# EAGLE schematic retrostoneA20-1.15 (EAGLE 7.6.0), part 1 of 2

## Sheet 1 of 2
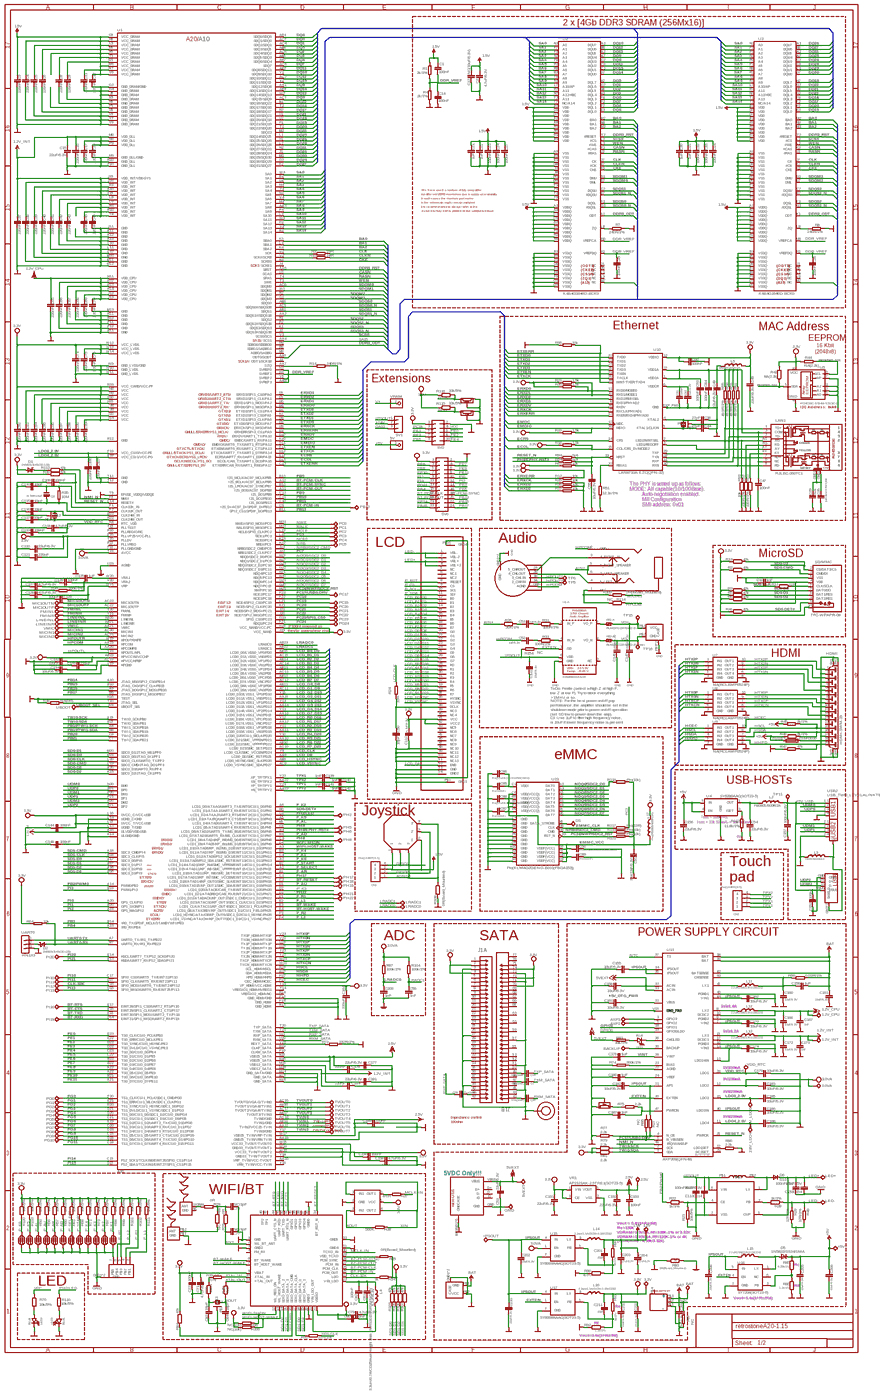
[diagram p0: schematic, sheet 1, overview]
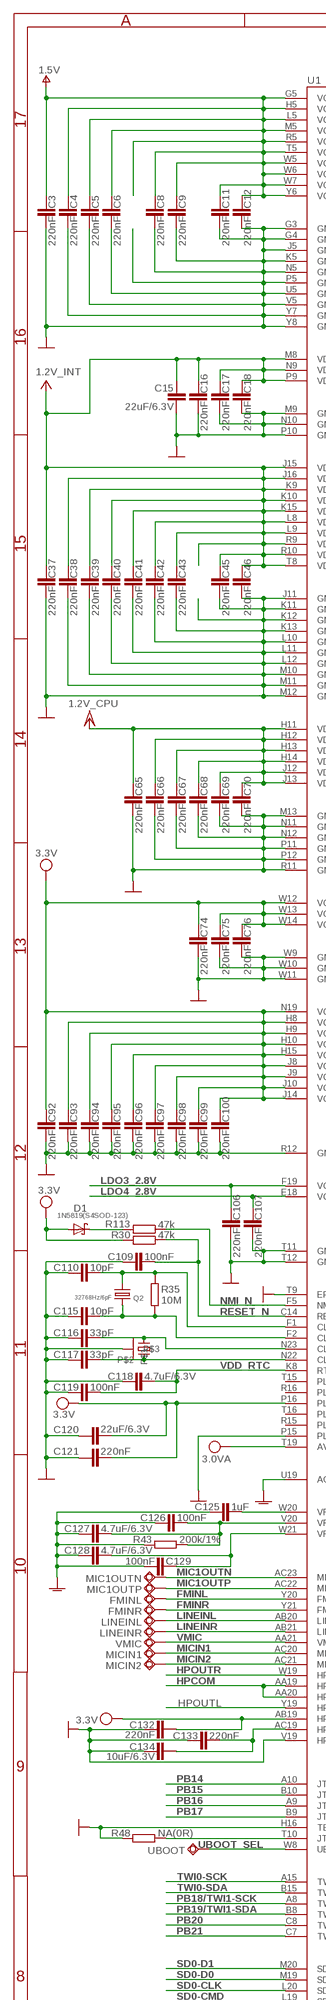
[diagram p1: schematic, sheet 1, part 1 of 4]
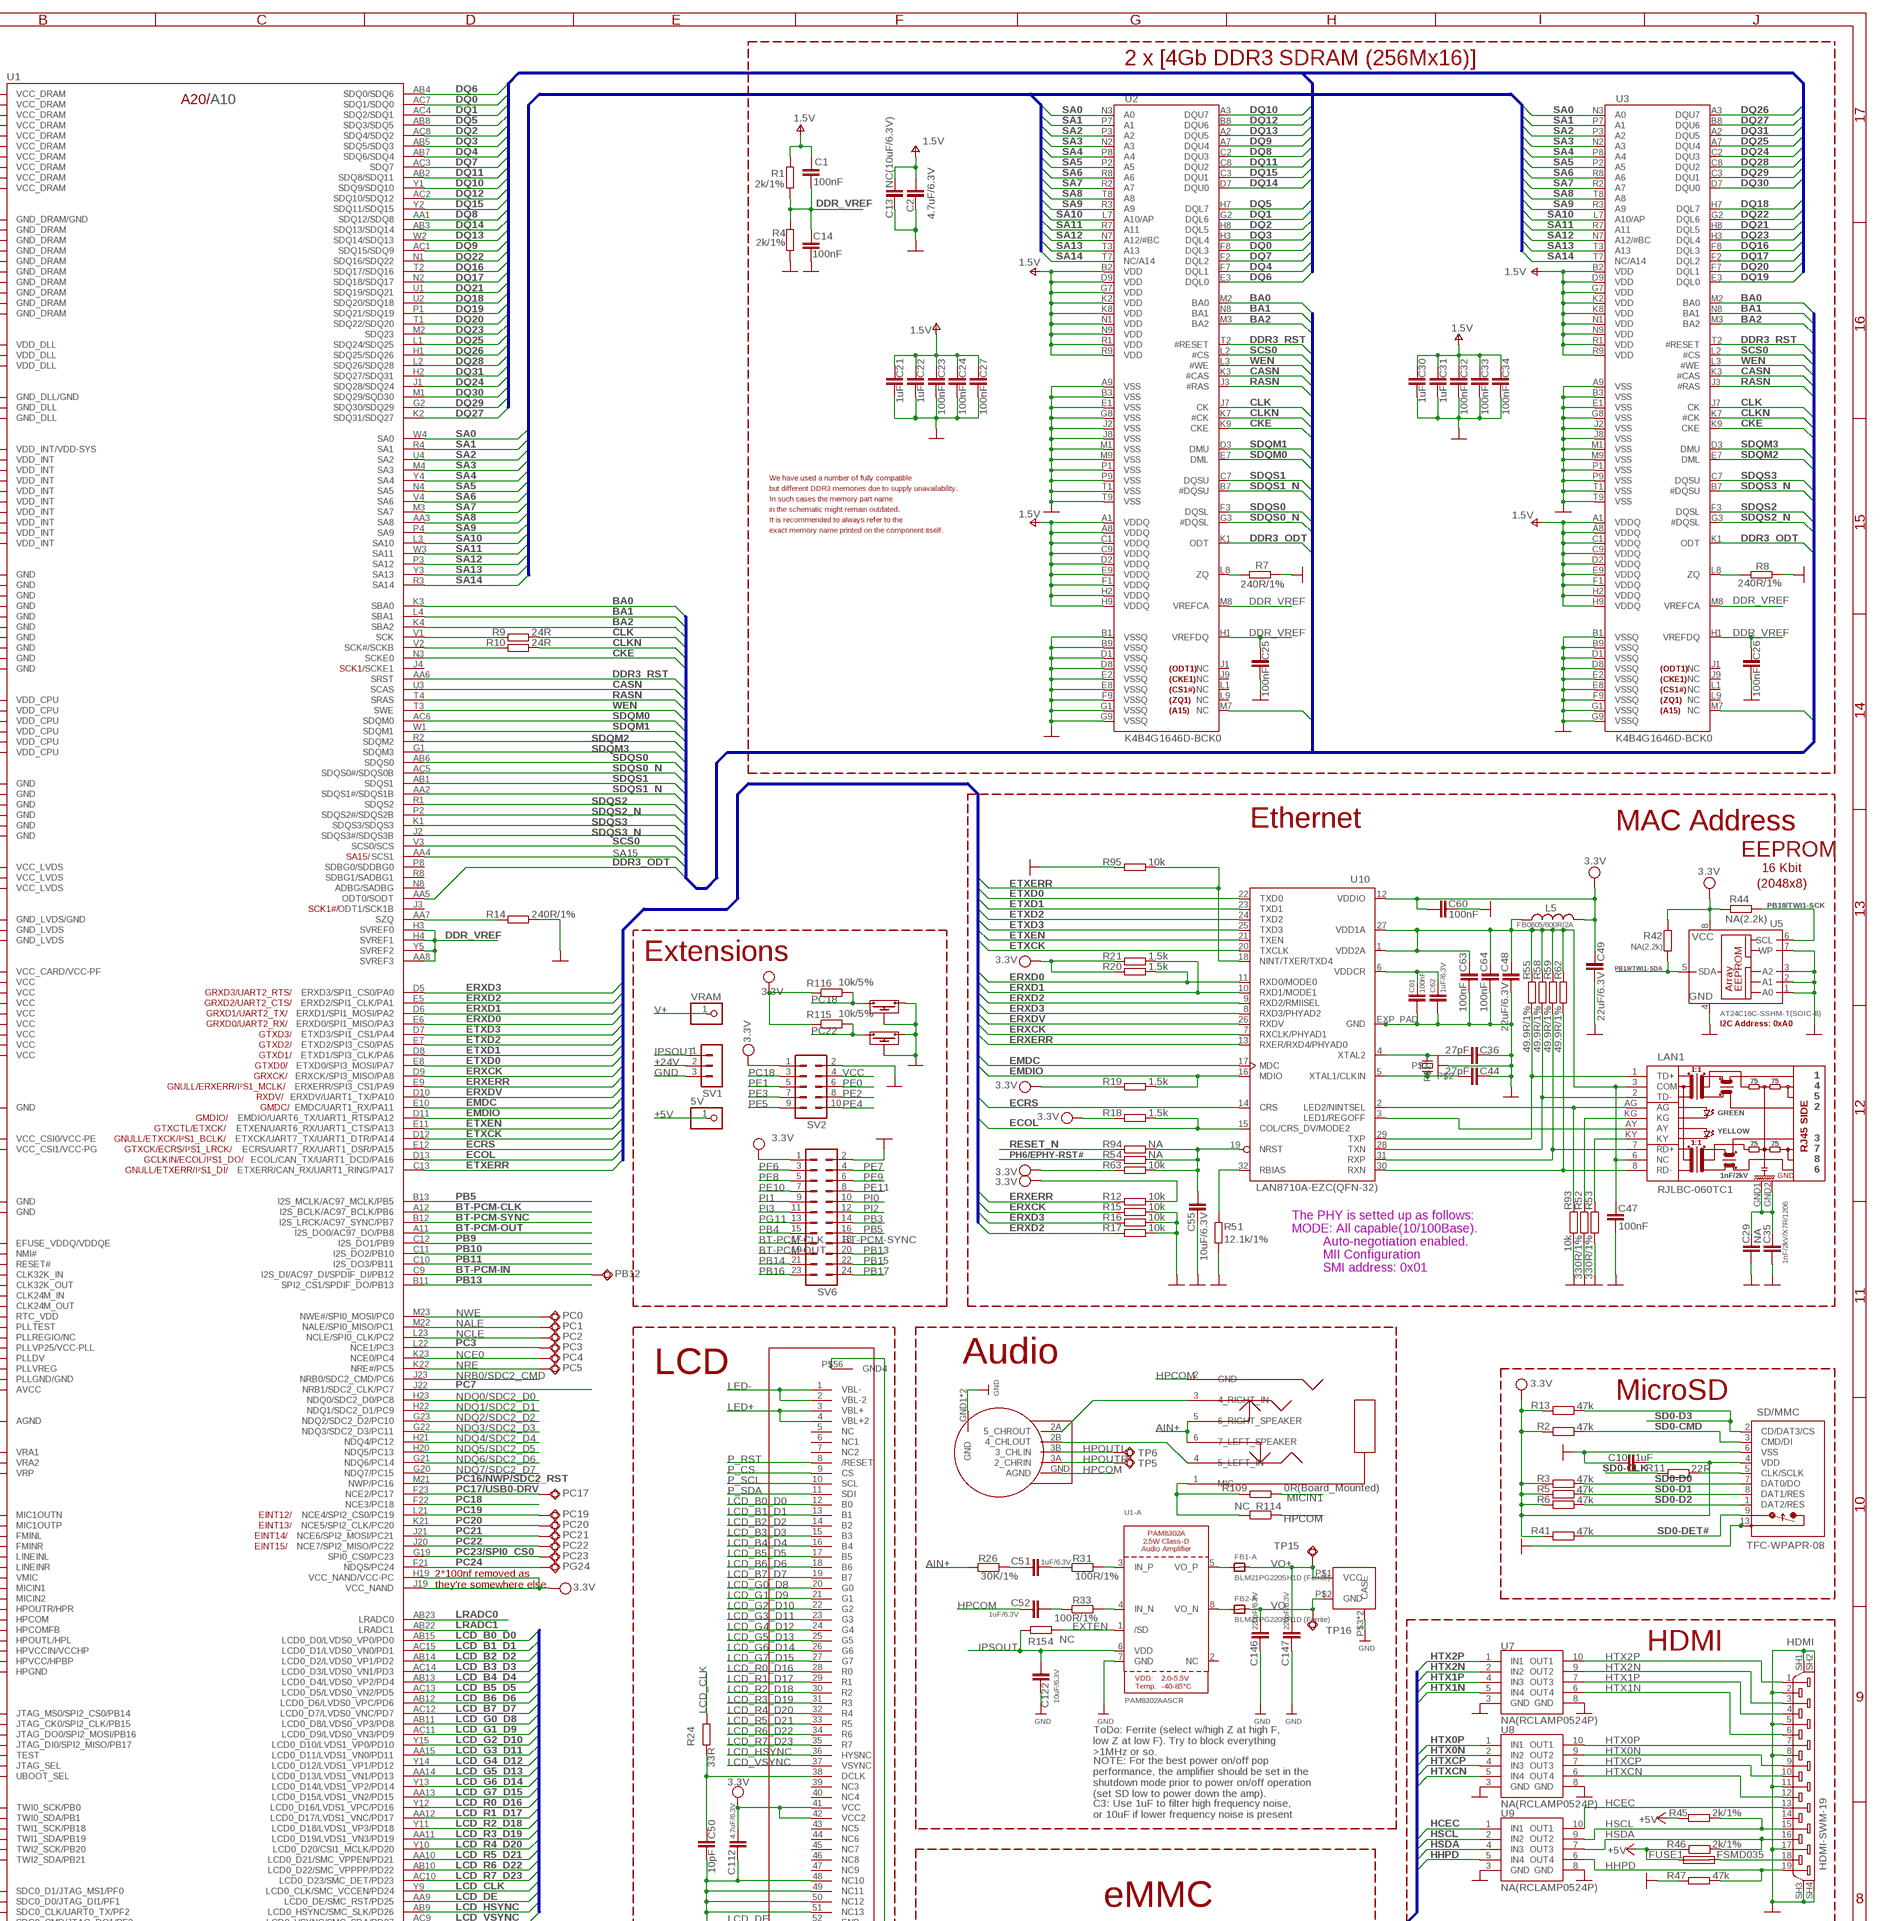
[diagram p2: schematic, sheet 1, part 2 of 4]
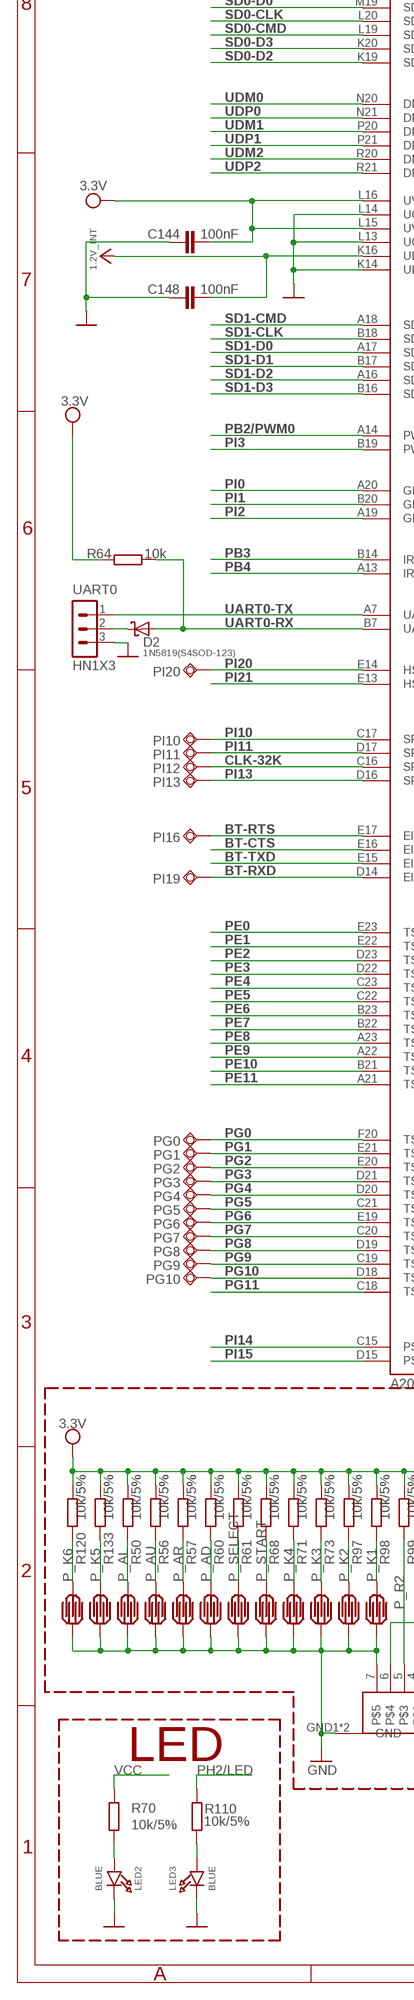
[diagram p3: schematic, sheet 1, part 3 of 4]
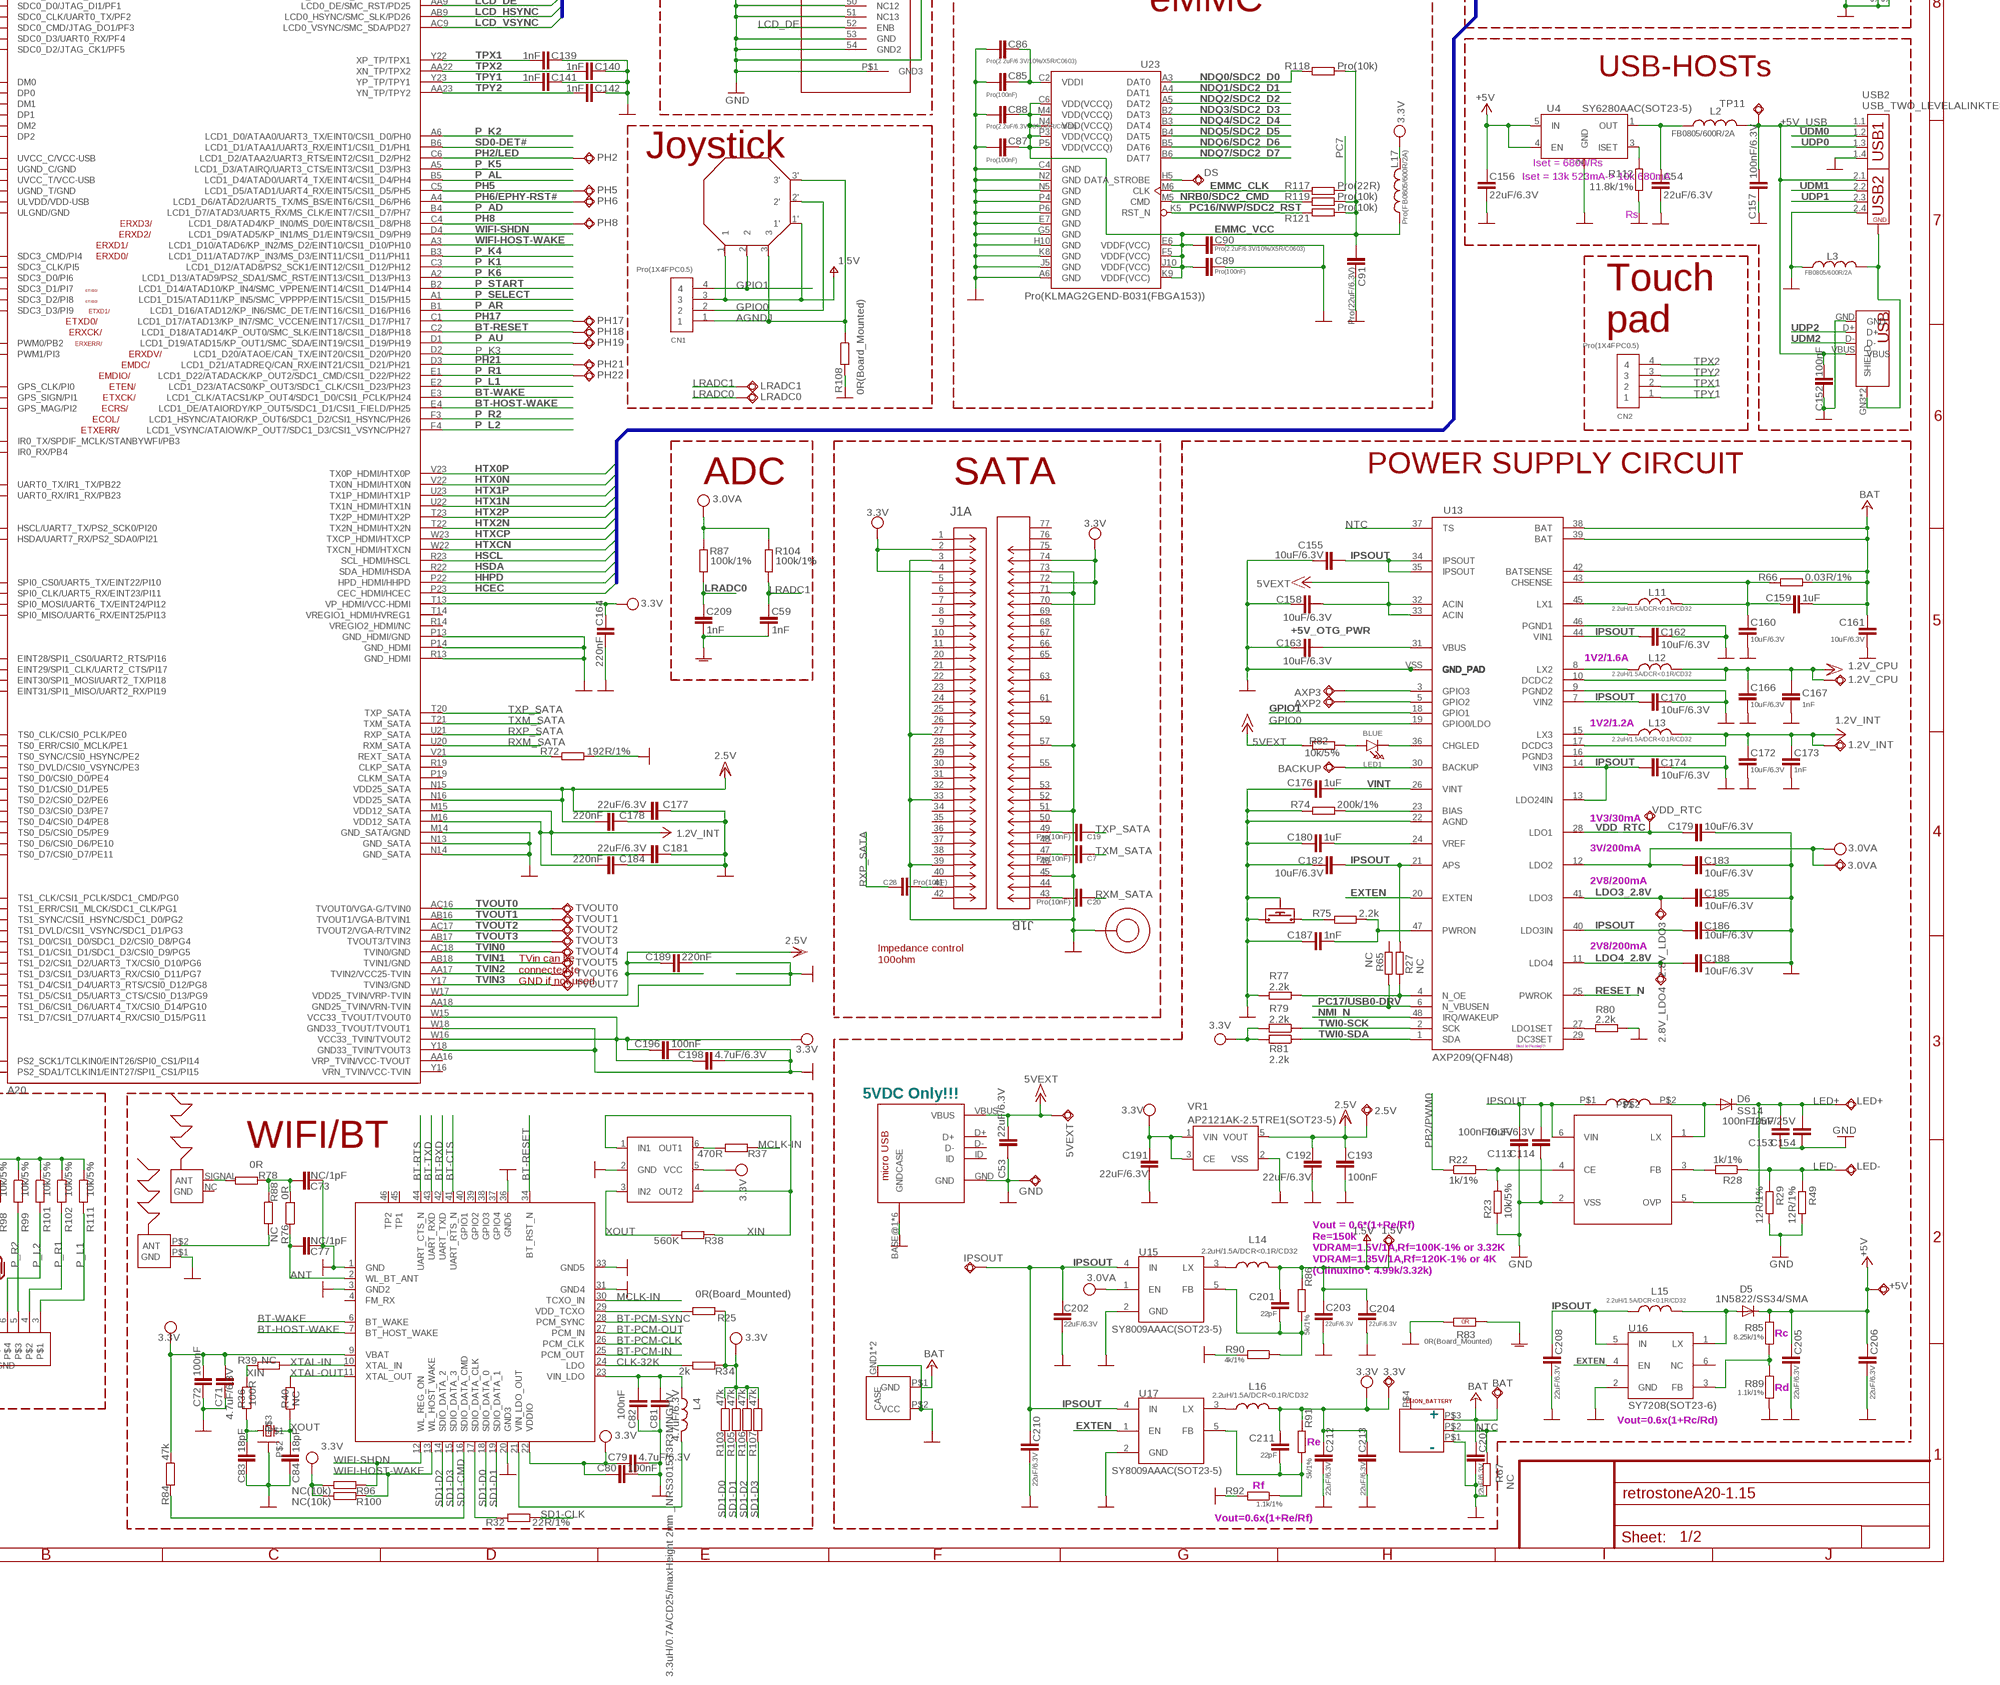
[diagram p4: schematic, sheet 1, part 4 of 4]

### Parts
1.2V_CPU  TESTPADTESTPAD_40-ROUND  [TESTPAD_40-ROUND]
1.2V_INT  TESTPADTESTPAD_40-ROUND  [TESTPAD_40-ROUND]
1.5V  TESTPADTESTPAD_40-ROUND  [TESTPAD_40-ROUND]
2.5V  TESTPADTESTPAD_40-ROUND  [TESTPAD_40-ROUND]
2.8V_LDO3  TESTPADTESTPAD_40-ROUND  [TESTPAD_40-ROUND]
2.8V_LDO4  TESTPADTESTPAD_40-ROUND  [TESTPAD_40-ROUND]
3.0VA  TESTPADTESTPAD_40-ROUND  [TESTPAD_40-ROUND]
3.3V  TESTPADTESTPAD_40-ROUND  [TESTPAD_40-ROUND]
5V  PINHD-1X1  [1X01]
5VEXT  TESTPADTESTPAD_40-ROUND  [TESTPAD_40-ROUND]
+5V  TESTPADTESTPAD_40-ROUND  [TESTPAD_40-ROUND]
AXP2  TESTPADTESTPAD30/30  [TESTPAD_30-ROUND]
AXP3  TESTPADTESTPAD30/30  [TESTPAD_30-ROUND]
BACKUP  TESTPADTESTPAD30/30  [TESTPAD_30-ROUND]
BAT  TESTPADTESTPAD_40-ROUND  [TESTPAD_40-ROUND]
C1  100nF  C-EUC0402_TI  [C0402_TI]
C2  4.7uF/6.3V  C-EUC0603_DWS  [C0603_DWS]
C3  220nF  C-EUC0402_TI  [C0402_TI]
C4  220nF  C-EUC0402_TI  [C0402_TI]
C5  220nF  C-EUC0402_TI  [C0402_TI]
C6  220nF  C-EUC0402_TI  [C0402_TI]
C7  Pro(10nF)  C-EUC0402_TI  [C0402_TI]
C8  220nF  C-EUC0402_TI  [C0402_TI]
C9  220nF  C-EUC0402_TI  [C0402_TI]
C10  1uF  C-EUC0402_TI  [C0402_TI]
C11  220nF  C-EUC0402_TI  [C0402_TI]
C12  220nF  C-EUC0402_TI  [C0402_TI]
C13  NC(10uF/6.3V)  C-EUC0603_DWS  [C0603_DWS]
C14  100nF  C-EUC0402_TI  [C0402_TI]
C15  22uF/6.3V  C-EUC0603_DWS  [C0603_DWS]
C16  220nF  C-EUC0402_TI  [C0402_TI]
C17  220nF  C-EUC0402_TI  [C0402_TI]
C18  220nF  C-EUC0402_TI  [C0402_TI]
C19  Pro(10nF)  C-EUC0402_TI  [C0402_TI]
C20  Pro(10nF)  C-EUC0402_TI  [C0402_TI]
C21  1uF  C-EUC0402_TI  [C0402_TI]
C22  1uF  C-EUC0402_TI  [C0402_TI]
C23  100nF  C-EUC0402_TI  [C0402_TI]
C24  100nF  C-EUC0402_TI  [C0402_TI]
C25  100nF  C-EUC0402_TI  [C0402_TI]
C26  100nF  C-EUC0402_TI  [C0402_TI]
C27  100nF  C-EUC0402_TI  [C0402_TI]
C28  Pro(10nF)  C-EUC0402_TI  [C0402_TI]
C29  NA  C-EUC1206_5MILS_WS_ISO  [C1206_5MILS_WS_ISO]
C30  1uF  C-EUC0402_TI  [C0402_TI]
C31  1uF  C-EUC0402_TI  [C0402_TI]
C32  100nF  C-EUC0402_TI  [C0402_TI]
C33  100nF  C-EUC0402_TI  [C0402_TI]
C34  100nF  C-EUC0402_TI  [C0402_TI]
C35  1nF/2kV/X7R/1206  C-EUC1206_5MILS_WS_ISO  [C1206_5MILS_WS_ISO]
C36  27pF  C-EUC0402_TI  [C0402_TI]
C37  220nF  C-EUC0402_TI  [C0402_TI]
C38  220nF  C-EUC0402_TI  [C0402_TI]
C39  220nF  C-EUC0402_TI  [C0402_TI]
C40  220nF  C-EUC0402_TI  [C0402_TI]
C41  220nF  C-EUC0402_TI  [C0402_TI]
C42  220nF  C-EUC0402_TI  [C0402_TI]
C43  220nF  C-EUC0402_TI  [C0402_TI]
C44  27pF  C-EUC0402_TI  [C0402_TI]
C45  220nF  C-EUC0402_TI  [C0402_TI]
C46  220nF  C-EUC0402_TI  [C0402_TI]
C47  100nF  C-EUC0402_TI  [C0402_TI]
C48  22uF/6.3V  C-EUC0603_DWS  [C0603_DWS]
C49  22uF/6.3V  C-EUC0603_DWS  [C0603_DWS]
C50  10pF  C-EUC0402_TI  [C0402_TI]
C51  1uF/6.3V  C-EUC0402_TI  [C0402_TI]
C52  1uF/6.3V  C-EUC0402_TI  [C0402_TI]
C53  22uF/6.3V  C-EUC0603_DWS  [C0603_DWS]
C54  22uF/6.3V  C-EUC0603_DWS  [C0603_DWS]
C55  10uF/6.3V  C-EUC0603_DWS  [C0603_DWS]
C59  1nF  C-EUC0402_TI  [C0402_TI]
C60  100nF  C-EUC0402_TI  [C0402_TI]
C61  100nF  C-EUC0402_TI  [C0402_TI]
C62  1uF/6.3V  C-EUC0603_DWS  [C0603_DWS]
C63  100nF  C-EUC0402_TI  [C0402_TI]
C64  100nF  C-EUC0402_TI  [C0402_TI]
C65  220nF  C-EUC0402_TI  [C0402_TI]
C66  220nF  C-EUC0402_TI  [C0402_TI]
C67  220nF  C-EUC0402_TI  [C0402_TI]
C68  220nF  C-EUC0402_TI  [C0402_TI]
C69  220nF  C-EUC0402_TI  [C0402_TI]
C70  220nF  C-EUC0402_TI  [C0402_TI]
C71  4.7uF/6.3V  C-EUC0603_DWS  [C0603_DWS]
C72  100nF  C-EUC0402_TI  [C0402_TI]
C73  NC/1pF  C-EUC0402_TI  [C0402_TI]
C74  220nF  C-EUC0402_TI  [C0402_TI]
C75  220nF  C-EUC0402_TI  [C0402_TI]
C76  220nF  C-EUC0402_TI  [C0402_TI]
C77  NC/1pF  C-EUC0402_TI  [C0402_TI]
C79  4.7uF/6.3V  C-EUC0603_DWS  [C0603_DWS]
C80  100nF  C-EUC0402_TI  [C0402_TI]
C81  4.7uF/6.3V  C-EUC0603_DWS  [C0603_DWS]
C82  100nF  C-EUC0402_TI  [C0402_TI]
C83  18pF  C-EUC0402_TI  [C0402_TI]
C84  18pF  C-EUC0402_TI  [C0402_TI]
C85  Pro(100nF)  C-EUC0402_TI  [C0402_TI]
C86  Pro(2.2uF/6.3V/10%/X5R/C0603)  C-EUC0603_DWS  [C0603_DWS]
C87  Pro(100nF)  C-EUC0402_TI  [C0402_TI]
C88  Pro(2.2uF/6.3V/10%/X5R/C0603)  C-EUC0603_DWS  [C0603_DWS]
C89  Pro(100nF)  C-EUC0402_TI  [C0402_TI]
C90  Pro(2.2uF/6.3V/10%/X5R/C0603)  C-EUC0603_DWS  [C0603_DWS]
C91  Pro(22uF/6.3V)  C-EUC0603_DWS  [C0603_DWS]
C92  220nF  C-EUC0402_TI  [C0402_TI]
C93  220nF  C-EUC0402_TI  [C0402_TI]
C94  220nF  C-EUC0402_TI  [C0402_TI]
C95  220nF  C-EUC0402_TI  [C0402_TI]
C96  220nF  C-EUC0402_TI  [C0402_TI]
C97  220nF  C-EUC0402_TI  [C0402_TI]
C98  220nF  C-EUC0402_TI  [C0402_TI]
C99  220nF  C-EUC0402_TI  [C0402_TI]
C100  220nF  C-EUC0402_TI  [C0402_TI]
C106  220nF  C-EUC0402_TI  [C0402_TI]
C107  220nF  C-EUC0402_TI  [C0402_TI]
C109  100nF  C-EUC0402_TI  [C0402_TI]
C110  10pF  C-EUC0402_TI  [C0402_TI]
C112  4.7uF/6.3V  C-EUC0603_DWS  [C0603_DWS]
C113  100nF/6.3V  C-EUC0402_TI  [C0402_TI]
C114  10uF/6.3V  C-EUC0603_DWS  [C0603_DWS]
C115  10pF  C-EUC0402_TI  [C0402_TI]
C116  33pF  C-EUC0402_TI  [C0402_TI]
C117  33pF  C-EUC0402_TI  [C0402_TI]
C118  4.7uF/6.3V  C-EUC0603_DWS  [C0603_DWS]
C119  100nF  C-EUC0402_TI  [C0402_TI]
C120  22uF/6.3V  C-EUC0603_DWS  [C0603_DWS]
C121  220nF  C-EUC0402_TI  [C0402_TI]
C122  10uF/6.3V  C-EUC0603_DWS  [C0603_DWS]
C125  1uF  C-EUC0402_TI  [C0402_TI]
C126  100nF  C-EUC0402_TI  [C0402_TI]
C127  4.7uF/6.3V  C-EUC0603_DWS  [C0603_DWS]
C128  4.7uF/6.3V  C-EUC0603_DWS  [C0603_DWS]
C129  100nF  C-EUC0402_TI  [C0402_TI]
C132  220nF  C-EUC0402_TI  [C0402_TI]
C133  220nF  C-EUC0402_TI  [C0402_TI]
C134  10uF/6.3V  C-EUC0603_DWS  [C0603_DWS]
C139  1nF  C-EUC0402_TI  [C0402_TI]
C140  1nF  C-EUC0402_TI  [C0402_TI]
C141  1nF  C-EUC0402_TI  [C0402_TI]
C142  1nF  C-EUC0402_TI  [C0402_TI]
C144  100nF  C-EUC0402_TI  [C0402_TI]
C146  220pF/6.3V  C-EUC0402_TI  [C0402_TI]
C147  220pF/6.3V  C-EUC0402_TI  [C0402_TI]
C148  100nF  C-EUC0402_TI  [C0402_TI]
C152  100nF  C-EUC0402_TI  [C0402_TI]
C153  100nF/25V  C-EUC0805_5MIL  [C0805_5MIL]
C154  10uF/25V  C-EUC0805_5MIL  [C0805_5MIL]
C155  10uF/6.3V  C-EUC0603_DWS  [C0603_DWS]
C156  22uF/6.3V  C-EUC0603_DWS  [C0603_DWS]
C157  100nF/6.3V  C-EUC0402_TI  [C0402_TI]
C158  10uF/6.3V  C-EUC0603_DWS  [C0603_DWS]
C159  1uF  C-EUC0603_DWS  [C0603_DWS]
C160  10uF/6.3V  C-EUC0603_DWS  [C0603_DWS]
C161  10uF/6.3V  C-EUC0603_DWS  [C0603_DWS]
C162  10uF/6.3V  C-EUC0603_DWS  [C0603_DWS]
C163  10uF/6.3V  C-EUC0603_DWS  [C0603_DWS]
C164  220nF  C-EUC0402_TI  [C0402_TI]
C166  10uF/6.3V  C-EUC0603_DWS  [C0603_DWS]
C167  1nF  C-EUC0402_TI  [C0402_TI]
C170  10uF/6.3V  C-EUC0603_DWS  [C0603_DWS]
C172  10uF/6.3V  C-EUC0603_DWS  [C0603_DWS]
C173  1nF  C-EUC0402_TI  [C0402_TI]
C174  10uF/6.3V  C-EUC0603_DWS  [C0603_DWS]
C176  1uF  C-EUC0402_TI  [C0402_TI]
C177  22uF/6.3V  C-EUC0603_DWS  [C0603_DWS]
C178  220nF  C-EUC0402_TI  [C0402_TI]
C179  10uF/6.3V  C-EUC0603_DWS  [C0603_DWS]
C180  1uF  C-EUC0402_TI  [C0402_TI]
C181  22uF/6.3V  C-EUC0603_DWS  [C0603_DWS]
C182  10uF/6.3V  C-EUC0603_DWS  [C0603_DWS]
C183  10uF/6.3V  C-EUC0603_DWS  [C0603_DWS]
C184  220nF  C-EUC0402_TI  [C0402_TI]
C185  10uF/6.3V  C-EUC0603_DWS  [C0603_DWS]
C186  10uF/6.3V  C-EUC0603_DWS  [C0603_DWS]
C187  1nF  C-EUC0402_TI  [C0402_TI]
C188  10uF/6.3V  C-EUC0603_DWS  [C0603_DWS]
C189  220nF  C-EUC0402_TI  [C0402_TI]
C191  22uF/6.3V  C-EUC0603_DWS  [C0603_DWS]
C192  22uF/6.3V  C-EUC0603_DWS  [C0603_DWS]
C193  100nF  C-EUC0402_TI  [C0402_TI]
C196  100nF  C-EUC0402_TI  [C0402_TI]
C198  4.7uF/6.3V  C-EUC0603_DWS  [C0603_DWS]
C201  22pF  C-EUC0402_TI  [C0402_TI]
C202  22uF/6.3V  C-EUC0603_DWS  [C0603_DWS]
C203  22uF/6.3V  C-EUC0603_DWS  [C0603_DWS]
C204  22uF/6.3V  C-EUC0603_DWS  [C0603_DWS]
C205  22uF/6.3V  C-EUC0603_DWS  [C0603_DWS]
C206  22uF/6.3V  C-EUC0603_DWS  [C0603_DWS]
C207  22uF/6.3V  C-EUC0603_DWS  [C0603_DWS]
C208  22uF/6.3V  C-EUC0603_DWS  [C0603_DWS]
C209  1nF  C-EUC0402_TI  [C0402_TI]
C210  22uF/6.3V  C-EUC0603_DWS  [C0603_DWS]
C211  22pF  C-EUC0402_TI  [C0402_TI]
C212  22uF/6.3V  C-EUC0603_DWS  [C0603_DWS]
C213  22uF/6.3V  C-EUC0603_DWS  [C0603_DWS]
CN1  Pro(1X4FPC0.5)  1X4FPC0.5  [FPC_0.5MM-4]
CN2  Pro(1X4FPC0.5)  1X4FPC0.5  [FPC_0.5MM-4]
D1  1N5819(S4SOD-123)  SCHOTKKY7.62SS-1N5819(S4SOD-123)  [SOD-123]
D2  1N5819(S4SOD-123)  SCHOTKKY7.62SS-1N5819(S4SOD-123)  [SOD-123]
D5  1N5822/SS34/SMA  D-MLL-41  [MELF-MLL41]
D6  SS14  DIODE-DO214AC  [DO214AC]
DOWN  PAD_BUTTON  [PAD_BUTTON]
DS  TESTPADTESTPAD_40-ROUND  [TESTPAD_40-ROUND]
FB1-A  BLM21PG220SH1D (Ferrite)  FERRITE_0805  [_0805]
FB2-A  BLM21PG220SH1D (Ferrite)  FERRITE_0805  [_0805]
FMINL  TESTPADTESTPAD_40-ROUND  [TESTPAD_40-ROUND]
FMINR  TESTPADTESTPAD_40-ROUND  [TESTPAD_40-ROUND]
FUSE1  FSMD035  FUSE  [1206]
GND  TESTPADTESTPAD_40-ROUND  [TESTPAD_40-ROUND]
HDMI  HDMI-SWM-19  HDMI-MC34931HDMI-SWM-19  [HDMI-SWM-19]
IPSOUT  TESTPADTESTPAD_40-ROUND  [TESTPAD_40-ROUND]
J1  Pro(1-2199230-5-LITE)  1-2199230-5-LITE  [CONN67_2199230_LITE]
K1  PAD_BUTTON  [PAD_BUTTON]
K2  PAD_BUTTON  [PAD_BUTTON]
K3  PAD_BUTTON  [PAD_BUTTON]
K4  PAD_BUTTON  [PAD_BUTTON]
L1  22uH/CD32  CD32_INDUCTOR  [CD32_INDUCTOR]
L2  FB0805/600R/2A  L-USL0805_5MIL_DWS  [L0805_5MIL_DWS]
L3  FB0805/600R/2A  L-USL0805_5MIL_DWS  [L0805_5MIL_DWS]
L4  3.3uH/0.7A/CD25/maxHeight 2mm _NRS3015T3R3MNGHV  LCD25_NRS3015T3R3MNGHV  [CD25]
L5  FB0805/600R/2A  L-USL0805_5MIL_DWS  [L0805_5MIL_DWS]
L11  2.2uH/1.5A/DCR<0.1R/CD32  L-CD32  [CD32]
L12  2.2uH/1.5A/DCR<0.1R/CD32  L-CD32  [CD32]
L13  2.2uH/1.5A/DCR<0.1R/CD32  L-CD32  [CD32]
L14  2.2uH/1.5A/DCR<0.1R/CD32  L-CD32  [CD32]
L15  2.2uH/1.5A/DCR<0.1R/CD32  L-CD32  [CD32]
L16  2.2uH/1.5A/DCR<0.1R/CD32  L-CD32  [CD32]
L17  Pro(FB0805/600R/2A)  L-USL0805_5MIL_DWS  [L0805_5MIL_DWS]
LAN1  RJLBC-060TC1  RJLBC-060TC1_GND_MILLING  [RJLBC-060TC1_MILLING]
LED1  BLUE  LED0805_NOOUTLINE  [CHIPLED_0805_NOOUTLINE]
LED2  BLUE  LED0805_NOOUTLINE  [CHIPLED_0805_NOOUTLINE]
LED3  BLUE  LED0805_NOOUTLINE  [CHIPLED_0805_NOOUTLINE]
LED+  TESTPADTESTPAD_40-ROUND  [TESTPAD_40-ROUND]
LED-  TESTPADTESTPAD_40-ROUND  [TESTPAD_40-ROUND]
LEFT  PAD_BUTTON  [PAD_BUTTON]
LINEINL  TESTPADTESTPAD_40-ROUND  [TESTPAD_40-ROUND]
LINEINR  TESTPADTESTPAD_40-ROUND  [TESTPAD_40-ROUND]
LRADC0  TESTPADTESTPAD_40-ROUND  [TESTPAD_40-ROUND]
LRADC1  TESTPADTESTPAD_40-ROUND  [TESTPAD_40-ROUND]
MIC1OUTN  TESTPADTESTPAD_40-ROUND  [TESTPAD_40-ROUND]
MIC1OUTP  TESTPADTESTPAD_40-ROUND  [TESTPAD_40-ROUND]
MICIN1  TESTPADTESTPAD_40-ROUND  [TESTPAD_40-ROUND]
MICIN2  TESTPADTESTPAD_40-ROUND  [TESTPAD_40-ROUND]
PB12  TESTPADTESTPAD_40-ROUND  [TESTPAD_40-ROUND]
PC0  TESTPADTESTPAD_40-ROUND  [TESTPAD_40-ROUND]
PC1  TESTPADTESTPAD_40-ROUND  [TESTPAD_40-ROUND]
PC2  TESTPADTESTPAD_40-ROUND  [TESTPAD_40-ROUND]
PC3  TESTPADTESTPAD_40-ROUND  [TESTPAD_40-ROUND]
PC4  TESTPADTESTPAD_40-ROUND  [TESTPAD_40-ROUND]
PC5  TESTPADTESTPAD_40-ROUND  [TESTPAD_40-ROUND]
PC17  TESTPADTESTPAD_40-ROUND  [TESTPAD_40-ROUND]
PC19  TESTPADTESTPAD_40-ROUND  [TESTPAD_40-ROUND]
PC20  TESTPADTESTPAD_40-ROUND  [TESTPAD_40-ROUND]
PC21  TESTPADTESTPAD_40-ROUND  [TESTPAD_40-ROUND]
PC22  TESTPADTESTPAD_40-ROUND  [TESTPAD_40-ROUND]
PC23  TESTPADTESTPAD_40-ROUND  [TESTPAD_40-ROUND]
PG0  TESTPADTESTPAD_40-ROUND  [TESTPAD_40-ROUND]
PG1  TESTPADTESTPAD_40-ROUND  [TESTPAD_40-ROUND]
PG2  TESTPADTESTPAD_40-ROUND  [TESTPAD_40-ROUND]
PG3  TESTPADTESTPAD_40-ROUND  [TESTPAD_40-ROUND]
PG4  TESTPADTESTPAD_40-ROUND  [TESTPAD_40-ROUND]
PG5  TESTPADTESTPAD_40-ROUND  [TESTPAD_40-ROUND]
PG6  TESTPADTESTPAD_40-ROUND  [TESTPAD_40-ROUND]
PG7  TESTPADTESTPAD_40-ROUND  [TESTPAD_40-ROUND]
PG8  TESTPADTESTPAD_40-ROUND  [TESTPAD_40-ROUND]
PG9  TESTPADTESTPAD_40-ROUND  [TESTPAD_40-ROUND]
PG10  TESTPADTESTPAD_40-ROUND  [TESTPAD_40-ROUND]
PG24  TESTPADTESTPAD_40-ROUND  [TESTPAD_40-ROUND]
PH2  TESTPADTESTPAD30/30  [TESTPAD_30-ROUND]
PH5  TESTPADTESTPAD30/30  [TESTPAD_30-ROUND]
PH6  TESTPADTESTPAD_40-ROUND  [TESTPAD_40-ROUND]
PH8  TESTPADTESTPAD_40-ROUND  [TESTPAD_40-ROUND]
PH17  TESTPADTESTPAD_40-ROUND  [TESTPAD_40-ROUND]
PH18  TESTPADTESTPAD_40-ROUND  [TESTPAD_40-ROUND]
PH19  TESTPADTESTPAD_40-ROUND  [TESTPAD_40-ROUND]
PH21  TESTPADTESTPAD_40-ROUND  [TESTPAD_40-ROUND]
PH22  TESTPADTESTPAD_40-ROUND  [TESTPAD_40-ROUND]
PI10  TESTPADTESTPAD_40-ROUND  [TESTPAD_40-ROUND]
PI11  TESTPADTESTPAD_40-ROUND  [TESTPAD_40-ROUND]
PI12  TESTPADTESTPAD_40-ROUND  [TESTPAD_40-ROUND]
PI13  TESTPADTESTPAD_40-ROUND  [TESTPAD_40-ROUND]
PI16  TESTPADTESTPAD_40-ROUND  [TESTPAD_40-ROUND]
PI19  TESTPADTESTPAD_40-ROUND  [TESTPAD_40-ROUND]
PI20  TESTPADTESTPAD_40-ROUND  [TESTPAD_40-ROUND]
Q2  32768Hz/6pF  MC-306_32.768KHZ/SMD_8038  [MC-306]
R1  2k/1%  R-EU_R0402_TI  [R0402_TI]
R2  47k  R-EU_R0402_TI  [R0402_TI]
R3  47k  R-EU_R0402_TI  [R0402_TI]
R4  2k/1%  R-EU_R0402_TI  [R0402_TI]
R5  47k  R-EU_R0402_TI  [R0402_TI]
R6  47k  R-EU_R0402_TI  [R0402_TI]
R7  240R/1%  R-EU_R0402_TI  [R0402_TI]
R8  240R/1%  R-EU_R0402_TI  [R0402_TI]
R9  24R  R-EU_R0402_TI  [R0402_TI]
R10  24R  R-EU_R0402_TI  [R0402_TI]
R11  22R  R-EU_R0402_TI  [R0402_TI]
R12  10k  R-EU_R0402_TI  [R0402_TI]
R13  47k  R-EU_R0402_TI  [R0402_TI]
R14  240R/1%  R-EU_R0402_TI  [R0402_TI]
R15  10k  R-EU_R0402_TI  [R0402_TI]
R16  10k  R-EU_R0402_TI  [R0402_TI]
R17  10k  R-EU_R0402_TI  [R0402_TI]
R18  1.5k  R-EU_R0402_TI  [R0402_TI]
R19  1.5k  R-EU_R0402_TI  [R0402_TI]
R20  1.5k  R-EU_R0402_TI  [R0402_TI]
R21  1.5k  R-EU_R0402_TI  [R0402_TI]
R22  1k/1%  R-EU_R0402_TI  [R0402_TI]
R23  10k/5%  R-EU_R0402_TI  [R0402_TI]
R24  33R  R-EU_R0402_TI  [R0402_TI]
R25  0R(Board_Mounted)  R-EU_R0402_TI_0R  [R0402_TI_0R]
R26  30K/1%  R-EU_R0402_TI  [R0402_TI]
R27  NC  R-EU_R0402_TI  [R0402_TI]
R28  1k/1%  R-EU_R0402_TI  [R0402_TI]
R29  12R/1%  R-EU_R0603_5MIL_DWS  [R0603_5MIL_DWS]
R30  47k  R-EU_R0402_TI  [R0402_TI]
R31  100R/1%  R-EU_R0402_TI  [R0402_TI]
R32  22R/1%  R-EU_R0402_TI  [R0402_TI]
R33  100R/1%  R-EU_R0402_TI  [R0402_TI]
R34  2k  R-EU_R0402_TI  [R0402_TI]
R35  10M  R-EU_R0402_TI  [R0402_TI]
R36  100R  R-EU_R0402_TI  [R0402_TI]
R37  470R  R-EU_R0402_TI  [R0402_TI]
R38  560K  R-EU_R0402_TI  [R0402_TI]
R39  NC  R-EU_R0402_TI  [R0402_TI]
R40  NC  R-EU_R0402_TI  [R0402_TI]
R41  47k  R-EU_R0402_TI  [R0402_TI]
R42  NA(2.2k)  R-EU_R0603_5MIL_DWS  [R0603_5MIL_DWS]
R43  200k/1%  R-EU_R0402_TI  [R0402_TI]
R44  NA(2.2k)  R-EU_R0603_5MIL_DWS  [R0603_5MIL_DWS]
R45  2k/1%  R-EU_R0402_TI  [R0402_TI]
R46  2k/1%  R-EU_R0402_TI  [R0402_TI]
R47  47k  R-EU_R0402_TI  [R0402_TI]
R48  NA(0R)  R-EU_R0402_TI  [R0402_TI]
R49  12R/1%  R-EU_R0603_5MIL_DWS  [R0603_5MIL_DWS]
R50  10k/5%  R-EU_R0402_TI  [R0402_TI]
R51  12.1k/1%  R-EU_R0402_TI  [R0402_TI]
R52  330R/1%  R-EU_R0603_5MIL_DWS  [R0603_5MIL_DWS]
R53  330R/1%  R-EU_R0603_5MIL_DWS  [R0603_5MIL_DWS]
R54  NA  R-EU_R0402_TI  [R0402_TI]
R55  49.9R/1%  R-EU_R0402_TI  [R0402_TI]
R56  10k/5%  R-EU_R0402_TI  [R0402_TI]
R57  10k/5%  R-EU_R0402_TI  [R0402_TI]
R58  49.9R/1%  R-EU_R0402_TI  [R0402_TI]
R59  49.9R/1%  R-EU_R0402_TI  [R0402_TI]
R60  10k/5%  R-EU_R0402_TI  [R0402_TI]
R61  10k/5%  R-EU_R0402_TI  [R0402_TI]
R62  49.9R/1%  R-EU_R0402_TI  [R0402_TI]
R63  10k  R-EU_R0402_TI  [R0402_TI]
R64  10k  R-EU_R0402_TI  [R0402_TI]
R65  NC  R-EU_R0402_TI  [R0402_TI]
R66  0.03R/1%  R-EU_R1206_5MIL_WS  [R1206_5MIL_WS]
R67  NC  R-EU_R0402_TI  [R0402_TI]
R68  10k/5%  R-EU_R0402_TI  [R0402_TI]
R70  10k/5%  R-EU_R0402_TI  [R0402_TI]
R71  10k/5%  R-EU_R0402_TI  [R0402_TI]
R72  192R/1%  R-EU_R0402_TI  [R0402_TI]
R73  10k/5%  R-EU_R0402_TI  [R0402_TI]
R74  200k/1%  R-EU_R0402_TI  [R0402_TI]
R75  2.2k  R-EU_R0402_TI  [R0402_TI]
R76  0R  R-EU_R0402_TI  [R0402_TI]
R77  2.2k  R-EU_R0402_TI  [R0402_TI]
R78  0R  R-EU_R0402_TI  [R0402_TI]
R79  2.2k  R-EU_R0402_TI  [R0402_TI]
R80  2.2k  R-EU_R0402_TI  [R0402_TI]
R81  2.2k  R-EU_R0402_TI  [R0402_TI]
R82  10k/5%  R-EU_R0402_TI  [R0402_TI]
R83  0R(Board_Mounted)  R_0R0R(NA)  [0603_0R]
R84  47k  R-EU_R0402_TI  [R0402_TI]
R85  8.25k/1%  R-EU_R0402_TI  [R0402_TI]
R86  5k/1%  R-EU_R0402_TI  [R0402_TI]
R87  100k/1%  R-EU_R0402_TI  [R0402_TI]
R88  NC  R-EU_R0402_TI  [R0402_TI]
R89  1.1k/1%  R-EU_R0402_TI  [R0402_TI]
R90  4k/1%  R-EU_R0402_TI  [R0402_TI]
R91  5k/1%  R-EU_R0402_TI  [R0402_TI]
R92  1.1k/1%  R-EU_R0402_TI  [R0402_TI]
R93  10k  R-EU_R0402_TI  [R0402_TI]
R94  NA  R-EU_R0402_TI  [R0402_TI]
R95  10k  R-EU_R0402_TI  [R0402_TI]
R96  NC(10k)  R-EU_R0402_TI  [R0402_TI]
R97  10k/5%  R-EU_R0402_TI  [R0402_TI]
R98  10k/5%  R-EU_R0402_TI  [R0402_TI]
R99  10k/5%  R-EU_R0402_TI  [R0402_TI]
R100  NC(10k)  R-EU_R0402_TI  [R0402_TI]
R101  10k/5%  R-EU_R0402_TI  [R0402_TI]
R102  10k/5%  R-EU_R0402_TI  [R0402_TI]
R103  47k  R-EU_R0402_TI  [R0402_TI]
R104  100k/1%  R-EU_R0402_TI  [R0402_TI]
R105  47k  R-EU_R0402_TI  [R0402_TI]
R106  47k  R-EU_R0402_TI  [R0402_TI]
R107  47k  R-EU_R0402_TI  [R0402_TI]
R108  0R(Board_Mounted)  R-EU_R0402_TI_0R  [R0402_TI_0R]
R109  0R(Board_Mounted)  R-EU_R0402_TI_0R  [R0402_TI_0R]
R110  10k/5%  R-EU_R0402_TI  [R0402_TI]
R111  10k/5%  R-EU_R0402_TI  [R0402_TI]
R112  11.8k/1%  R-EU_R0402_TI  [R0402_TI]
R113  47k  R-EU_R0402_TI  [R0402_TI]
R114  NC  R-EU_R0402_TI  [R0402_TI]
R115  10k/5%  R-EU_R0402_TI  [R0402_TI]
R116  10k/5%  R-EU_R0402_TI  [R0402_TI]
R117  Pro(22R)  R-EU_R0402_TI  [R0402_TI]
R118  Pro(10k)  R-EU_R0402_TI  [R0402_TI]
R119  Pro(10k)  R-EU_R0402_TI  [R0402_TI]
R120  10k/5%  R-EU_R0402_TI  [R0402_TI]
R121  Pro(10k)  R-EU_R0402_TI  [R0402_TI]
R133  10k/5%  R-EU_R0402_TI  [R0402_TI]
R154  NC  R-EU_R0402_TI  [R0402_TI]
RIGHT  PAD_BUTTON  [PAD_BUTTON]
SD/MMC  TFC-WPAPR-08  MICRO_SD/MMC_CP_NEWTFC-WPAPR-08  [TFC-WPAPR-08]
SELECT  PAD_BUTTON  [PAD_BUTTON]
SELECT3  PAD_BUTTON  [PAD_BUTTON]
SELECT4  PAD_BUTTON  [PAD_BUTTON]
START  PAD_BUTTON  [PAD_BUTTON]
SV1  MA03-1  [MA03-1]
SV2  MA05-2  [MA05-2]
SV6  MA12-2  [MA12-2]
TP5  TESTPADTESTPAD_40-ROUND  [TESTPAD_40-ROUND]
TP6  TESTPADTESTPAD_40-ROUND  [TESTPAD_40-ROUND]
TP11  TESTPADTESTPAD_40-ROUND  [TESTPAD_40-ROUND]
TP15  TESTPADTESTPAD_40-ROUND  [TESTPAD_40-ROUND]
TP16  TESTPADTESTPAD_40-ROUND  [TESTPAD_40-ROUND]
TVOUT0  TESTPADTESTPAD_40-ROUND  [TESTPAD_40-ROUND]
TVOUT1  TESTPADTESTPAD30/30  [TESTPAD_30-ROUND]
TVOUT2  TESTPADTESTPAD_40-ROUND  [TESTPAD_40-ROUND]
TVOUT3  TESTPADTESTPAD_40-ROUND  [TESTPAD_40-ROUND]
TVOUT4  TESTPADTESTPAD30/30  [TESTPAD_30-ROUND]
TVOUT5  TESTPADTESTPAD30/30  [TESTPAD_30-ROUND]
TVOUT6  TESTPADTESTPAD30/30  [TESTPAD_30-ROUND]
TVOUT7  TESTPADTESTPAD30/30  [TESTPAD_30-ROUND]
U1  A20  A10  [TFBGA441]
U1-A  PAM8302AASCR  AUDIOAMP_PAM8302A  [MSOP8_0.65MM]
U2  K4B4G1646D-BCK0  H5TQ2G63BFR_MEM4G16D3EABG-125HYNIX  [FBGA96_SK]
U3  K4B4G1646D-BCK0  H5TQ2G63BFR_MEM4G16D3EABG-125HYNIX  [FBGA96_SK]
U4  SY6280AAC(SOT23-5)  SY6280  [SOT23-5]
U5  AT24C16C-SSHM-T(SOIC-8)  24LCXX  [SO-08MN]
U7  NA(RCLAMP0524P)  RCLAMP0524P  [SLP2510P8]
U8  NA(RCLAMP0524P)  RCLAMP0524P  [SLP2510P8]
U9  NA(RCLAMP0524P)  RCLAMP0524P  [SLP2510P8]
U10  LAN8710A-EZC(QFN-32)  LAN8710A-EZC  [QFN-32(DRILLS)]
U13  AXP209(QFN48)  AXP209  [QFN48]
U14  KA2707  [SOT23-6]
U15  SY8009AAAC(SOT23-5)  SY8008  [SOT23-5]
U16  SY7208(SOT23-6)  SY7208  [SOT23-6]
U17  SY8009AAAC(SOT23-5)  SY8008  [SOT23-5]
U23  Pro(KLMAG2GEND-B031(FBGA153))  KLMAG2GEND-B031(FBGA153)  [FBGA153]
U$1  USB_HAYATO  [USBA_HAYATO]
U$2  AP6210  AP6212  [AP6212]
U$3  26MHZ_12pF  TSX-3225  [TSX-3225]
U$4  JST_PH_VERT_5P  [JST_PH_VERT_5P]
U$5  TACT_SWITCH_HORIZONTAL  [TACT_SWITCH_HORIZONTAL]
U$6  NC(JST_PH_VERT_2P)  JST_PH_VERT_2P  [JST_PH_VERT_2P]
U$7  FPC_HAYATO  [FPC_HAYATO]
U$8  ESP8089_ANTSYM  [ANT_ESP8206_SYM]
U$15  JST2_HAYATO1.25_HOR_2PIN  [JST1.25_HOR_2P]
U$17  MICROUSB_HAYATO  [MICROUSB_HAYATO]
U$18  BC-75-3PD700(750-800)  BATTERY_CON_3PIN  [BATTERY_CON_3PIN]
U$20  SCREW_M2_04  [SCREW_M2_04]
U$21  24MHz/20ppm/20pF  TSX-3225  [TSX-3225]
U$23  25MHZ/20pF/20ppm  TSX-3225  [TSX-3225]
U$24  PJ342_5PIN  [PJ342_6P]
U$27  WHEEL_POT  [WHEEL_POT]
U$29  NL27WZU04  [SOT23-6]
U$30  ANT_H2U262GKBA0100  [ANT_H2U262GKBA0100]
U$31  TACT_SWITCH_HORIZONTAL  [TACT_SWITCH_HORIZONTAL]
U$32  TACT_SWITCH_HORIZONTAL  [TACT_SWITCH_HORIZONTAL]
U$33  JOYSTICK-POT  [JOYSTICK-POT]
UART0  HN1X3  CON3HN1X3  [HN1X3]
UBOOT  TESTPADTESTPAD_40-ROUND  [TESTPAD_40-ROUND]
UP  PAD_BUTTON  [PAD_BUTTON]
USB2  USB_TWO_LEVELALINKTEK  [USB_TWO_LEVEL_ALINKTEK]
VDD_RTC  TESTPADTESTPAD_40-ROUND  [TESTPAD_40-ROUND]
VMIC  TESTPADTESTPAD_40-ROUND  [TESTPAD_40-ROUND]
VR1  AP2121AK-2.5TRE1(SOT23-5)  AP1231-33  [SOT-23-5]
VRAM  PINHD-1X1  [1X01]

### Nets
5VEXT: 5VEXT.1(PP) C53.2 C158.2 R82.1 U13.32(ACIN) U13.33(ACIN) U$17.VBUS
+5V: 5V.1 +5V.1(PP) C156.1 C205.1 C206.1 D5.1(C) FUSE1.1 R45.2 R46.2 R85.2 U4.4(EN) U4.5(IN)
+5V_OTG_PWR: C163.2 U13.31(VBUS)
+5V_USB: C152.1 C157.1 L2.1 TP11.1(PP) U$1.VBUS USB2.1.1 USB2.2.1
+24V: BAT.1(PP) C159.2 C161.1 C207.2 R66.2 SV1.2 U13.38(BAT) U13.39(BAT) U13.42(BATSENSE) U$6.P$1(GND) U$18.P$3 ; supply symbol labelled BAT
AGNDJ: CN1.1 R108.1 U$33.3 U$33.3'
AIN+: R26.1 U$24.5(6_RIGHT_SPEAKER) U$24.6(7_LEFT_SPEAKER)
ANT: C77.2 R76.1 U$2.2(WL_BT_ANT)
BA0: U1.K3(SBA0) U2.M2(BA0) U3.M2(BA0)
BA1: U1.L4(SBA1) U2.N8(BA1) U3.N8(BA1)
BA2: U1.K4(SBA2) U2.M3(BA2) U3.M3(BA2)
BT-CTS: U1.E16(EINT29/SPI1_CLK/UART2_CTS/PI17) U$2.41(UART_RTS_N)
BT-HOST-WAKE: U1.E4(LCD1_DE/ATAIORDY/KP_OUT5/SDC1_D1/CSI1_FIELD/PH25) U$2.7(BT_HOST_WAKE)
BT-PCM-CLK: SV6.17 U1.A12(I2S_BCLK/AC97_BCLK/PB6) U$2.26(PCM_CLK)
BT-PCM-IN: PB12.1(PP) U1.C9(I2S_DI/AC97_DI/SPDIF_DI/PB12) U$2.25(PCM_OUT)
BT-PCM-OUT: SV6.19 U1.A11(I2S_DO0/AC97_DO/PB8) U$2.27(PCM_IN)
BT-PCM-SYNC: SV6.18 U1.B12(I2S_LRCK/AC97_SYNC/PB7) U$2.28(PCM_SYNC)
BT-RESET: PH18.1(PP) U1.C2(LCD1_D18/ATAD14/KP_OUT0/SMC_SLK/EINT18/CSI1_D18/PH18) U$2.34(BT_RST_N)
BT-RTS: PI16.1(PP) U1.E17(EINT28/SPI1_CS0/UART2_RTS/PI16) U$2.44(UART_CTS_N)
BT-RXD: PI19.1(PP) U1.D14(EINT31/SPI1_MISO/UART2_RX/PI19) U$2.42(UART_TXD)
BT-TXD: U1.E15(EINT30/SPI1_MOSI/UART2_TX/PI18) U$2.43(UART_RXD)
BT-WAKE: U1.E3(LCD1_CLK/ATACS1/KP_OUT4/SDC1_D0/CSI1_PCLK/PH24) U$2.6(BT_WAKE)
CASN: U1.U3(SCAS) U2.K3(#CAS) U3.K3(#CAS)
CHASSIS [PWR]: C29.2 C35.2 LAN1.GND1 LAN1.GND2
CKE: U1.N3(SCKE0) U2.K9(CKE) U3.K9(CKE)
CLK: R9.1 U2.J7(CK) U3.J7(CK)
CLK-32K: PI12.1(PP) R34.1 U1.C16(SPI0_MOSI/UART6_TX/EINT24/PI12) U$2.24(LDO)
CLKN: R10.1 U2.K7(#CK) U3.K7(#CK)
DDR3_ODT: U1.AA5(ODT0/SODT) U2.K1(ODT) U3.K1(ODT)
DDR3_RST: U1.AA6(SRST) U2.T2(#RESET) U3.T2(#RESET)
DDR_VREF: C1.2 C14.2 C25.2 C26.2 R1.1 R4.2 U1.AA8(SVREF3) U1.H3(SVREF0) U1.H4(SVREF1) U1.Y5(SVREF2) U2.H1(VREFDQ) U2.M8(VREFCA) U3.H1(VREFDQ) U3.M8(VREFCA)
DQ0: U1.AC7(SDQ1/SDQ0) U2.F8(DQL3)
DQ1: U1.AC4(SDQ2/SDQ1) U2.G2(DQL6)
DQ2: U1.AC8(SDQ4/SDQ2) U2.H8(DQL5)
DQ3: U1.AB5(SDQ5/SDQ3) U2.H3(DQL4)
DQ4: U1.AB7(SDQ6/SDQ4) U2.F7(DQL1)
DQ5: U1.AB8(SDQ3/SDQ5) U2.H7(DQL7)
DQ6: U1.AB4(SDQ0/SDQ6) U2.E3(DQL0)
DQ7: U1.AC3(SDQ7) U2.F2(DQL2)
DQ8: U1.AA1(SDQ12/SDQ8) U2.C2(DQU3)
DQ9: U1.AC1(SDQ15/SDQ9) U2.A7(DQU4)
DQ10: U1.Y1(SDQ9/SDQ10) U2.A3(DQU7)
DQ11: U1.AB2(SDQ8/SDQ11) U2.C8(DQU2)
DQ12: U1.AC2(SDQ10/SDQ12) U2.B8(DQU6)
DQ13: U1.W2(SDQ14/SDQ13) U2.A2(DQU5)
DQ14: U1.AB3(SDQ13/SDQ14) U2.D7(DQU0)
DQ15: U1.Y2(SDQ11/SDQ15) U2.C3(DQU1)
DQ16: U1.T2(SDQ17/SDQ16) U3.F8(DQL3)
DQ17: U1.N2(SDQ18/SDQ17) U3.F2(DQL2)
DQ18: U1.U2(SDQ20/SDQ18) U3.H7(DQL7)
DQ19: U1.P1(SDQ21/SDQ19) U3.E3(DQL0)
DQ20: U1.T1(SDQ22/SDQ20) U3.F7(DQL1)
DQ21: U1.U1(SDQ19/SDQ21) U3.H8(DQL5)
DQ22: U1.N1(SDQ16/SDQ22) U3.G2(DQL6)
DQ23: U1.M2(SDQ23) U3.H3(DQL4)
DQ24: U1.J1(SDQ28/SDQ24) U3.C2(DQU3)
DQ25: U1.L1(SDQ24/SDQ25) U3.A7(DQU4)
DQ26: U1.H1(SDQ25/SDQ26) U3.A3(DQU7)
DQ27: U1.K2(SDQ31/SDQ27) U3.B8(DQU6)
DQ28: U1.L2(SDQ26/SDQ28) U3.C8(DQU2)
DQ29: U1.G2(SDQ30/SDQ29) U3.C3(DQU1)
DQ30: U1.M1(SDQ29/SQD30) U3.D7(DQU0)
DQ31: U1.H2(SDQ27/SDQ31) U3.A2(DQU5)
ECOL: R18.2 U1.D13(ECOL/CAN_TX/UART1_DCD/PA16) U10.15(COL/CRS_DV/MODE2)
ECRS: U1.E12(ECRS/UART7_RX/UART1_DSR/PA15) U10.14(CRS)
EMDC: U1.E10(EMDC/UART1_RX/PA11) U10.17(MDC)
EMDIO: R19.2 U1.D11(EMDIO/UART6_TX/UART1_RTS/PA12) U10.16(MDIO)
EMMC_CLK: R117.2 U23.M6(CLK)
EMMC_VCC [PWR]: C87.1 C88.2 C89.1 C90.2 C91.1 L17.2 R118.1 R119.1 R121.1 U23.C6(VDD(VCCQ)) U23.E6(VDDF(VCC)) U23.F5(VDDF(VCC)) U23.J10(VDDF(VCC)) U23.K9(VDDF(VCC)) U23.M4(VDD(VCCQ)) U23.N4(VDD(VCCQ)) U23.P3(VDD(VCCQ)) U23.P5(VDD(VCCQ))
ERXCK: R15.1 U1.D9(ERXCK/SPI3_MISO/PA8) U10.7(RXCLK/PHYAD1)
ERXD0: R20.2 U1.E6(ERXD0/SPI1_MISO/PA3) U10.11(RXD0/MODE0)
ERXD1: R21.2 U1.D6(ERXD1/SPI1_MOSI/PA2) U10.10(RXD1/MODE1)
ERXD2: R17.1 U1.E5(ERXD2/SPI1_CLK/PA1) U10.9(RXD2/RMIISEL)
ERXD3: R16.1 U1.D5(ERXD3/SPI1_CS0/PA0) U10.8(RXD3/PHYAD2)
ERXDV: U1.D10(ERXDV/UART1_TX/PA10) U10.26(RXDV)
ERXERR: R12.1 U1.E9(ERXERR/SPI3_CS1/PA9) U10.13(RXER/RXD4/PHYAD0)
ETHERNET_VDD: C47.2 C48.2 C63.2 C64.2 L5.1 LAN1.3(COM) LAN1.6(NC) R55.2 R58.2 R59.2 R62.2 U10.1(VDD2A) U10.27(VDD1A)
ETXCK: U1.D12(ETXCK/UART7_TX/UART1_DTR/PA14) U10.20(TXCLK)
ETXD0: U1.E8(ETXD0/SPI3_MOSI/PA7) U10.22(TXD0)
ETXD1: U1.D8(ETXD1/SPI3_CLK/PA6) U10.23(TXD1)
ETXD2: U1.E7(ETXD2/SPI3_CS0/PA5) U10.24(TXD2)
ETXD3: U1.D7(ETXD3/SPI1_CS1/PA4) U10.25(TXD3)
ETXEN: U1.E11(ETXEN/UART6_RX/UART1_CTS/PA13) U10.21(TXEN)
ETXERR: R95.2 U1.C13(ETXERR/CAN_RX/UART1_RING/PA17) U10.18(NINT/TXER/TXD4)
EXTEN: R154.2 U1-A.1(/SD) U13.20(EXTEN) U16.4(EN) U17.1(EN)
FMINL: FMINL.1(PP) U1.Y20(FMINL)
FMINR: FMINR.1(PP) U1.Y21(FMINR)
GND [PWR]: C2.1 C3.1 C4.1 C5.1 C6.1 C8.1 C9.1 C10.2 C11.1 C12.1 C13.1 C14.1 C15.1 C16.1 C17.1 C18.1 C21.1 C22.1 C23.1 C24.1 C25.1 C26.1 C27.1 C29.1 C30.1 C31.1 C32.1 C33.1 C34.1 C35.1 C36.1 C37.1 C38.1 C39.1 C40.1 C41.1 C42.1 C43.1 C44.1 C45.1 C46.1 C47.1 C48.1 C49.1 C50.2 C53.1 C54.2 C55.1 C60.1 C61.1 C62.1 C63.1 C64.1 C65.1 C66.1 C67.1 C68.1 C69.1 C70.1 C71.2 C72.1 C73.1 C74.1 C75.1 C76.1 C77.1 C79.1 C80.2 C81.2 C82.1 C83.1 C84.1 C85.2 C86.1 C87.2 C88.1 C89.2 C90.1 C91.2 C92.1 C93.1 C94.1 C95.1 C96.1 C97.1 C98.1 C99.1 C100.1 C106.1 C107.1 C109.1 C110.1 C112.1 C113.1 C114.1 C115.1 C116.1 C117.1 C118.1 C119.1 C120.1 C121.1 C122.1 C132.1 C133.1 C134.1 C139.1 C140.1 C141.1 C142.1 C144.1 C146.1 C147.1 C148.1 C152.2 C153.1 C154.1 C155.1 C156.2 C157.2 C158.1 C160.2 C161.2 C162.2 C163.1 C164.2 C166.2 C167.2 C170.2 C172.2 C173.2 C174.2 C176.1 C177.1 C178.1 C179.2 C180.1 C181.1 C182.1 C183.2 C184.1 C185.2 C186.2 C187.1 C188.2 C189.2 C191.2 C192.2 C193.2 C196.2 C198.1 C202.2 C203.2 C204.2 C205.2 C206.2 C207.1 C208.1 C210.2 C212.2 C213.2 DOWN.P$2(S) GND.1(PP) HDMI.2 HDMI.5 HDMI.8 HDMI.11 HDMI.17 HDMI.SH1 HDMI.SH2 HDMI.SH3 HDMI.SH4 J1.3 J1.27 J1.33 J1.39 J1.45 J1.51 J1.57 J1.71 J1.73 K1.P$2(S) K2.P$2(S) K3.P$2(S) K4.P$2(S) L3.1 LED2.C LED3.C LEFT.P$2(S) R4.1 R7.1 R8.1 R14.1 R15.2 R16.2 R17.2 R23.1 R29.2 R47.2 R48.2 R49.2 R51.1 R52.2 R53.2 R67.2 R72.1 R74.1 R77.1 R80.2 R83.1(1.1) R89.2 R90.2 R92.2 R93.2 R95.1 R108.2 R112.1 RIGHT.P$2(S) SD/MMC.6(VSS) SD/MMC.10(PACK1) SD/MMC.11(PACK2) SD/MMC.12(PACK3) SD/MMC.13(PACK4) SELECT3.P$2(S) SELECT4.P$2(S) SELECT.P$2(S) START.P$2(S) SV1.3 SV2.2 SV6.2 U1-A.7(GND) U1.AA18(GND25_TVIN/VRN-TVIN) U1.G3(GND_DRAM/GND) U1.G4(GND_DRAM) U1.H16(TEST) U1.J5(GND_DRAM) U1.J11(GND) U1.K5(GND_DRAM) U1.K11(GND) U1.K12(GND) U1.K13(GND) U1.K14(ULGND/GND) U1.L10(GND) U1.L11(GND) U1.L12(GND) U1.L13(UGND_T/GND) U1.L14(UGND_C/GND) U1.M9(GND_DLL/GND) U1.M10(GND) U1.M11(GND) U1.M12(GND) U1.M13(GND) U1.M14(GND_SATA/GND) U1.N5(GND_DRAM) U1.N10(GND_DLL) U1.N11(GND) U1.N12(GND) U1.N13(GND_SATA) U1.N14(GND_SATA) U1.P5(GND_DRAM) U1.P10(GND_DLL) U1.P11(GND) U1.P12(GND) U1.P13(GND_HDMI/GND) U1.P14(GND_HDMI) U1.P15(PLLGND/GND) U1.R11(GND) U1.R12(GND) U1.R13(GND_HDMI) U1.T9(EFUSE_VDDQ/VDDQE) U1.T11(GND) U1.T12(GND) U1.U5(GND_DRAM) U1.V5(GND_DRAM) U1.V19(HPGND) U1.W9(GND_LVDS/GND) U1.W10(GND_LVDS) U1.W11(GND_LVDS) U1.W18(GND33_TVOUT/TVOUT1) U1.Y7(GND_DRAM) U1.Y8(GND_DRAM) U1.Y18(GND33_TVIN/TVOUT3) U2.A9(VSS) U2.B1(VSSQ) U2.B3(VSS) U2.B9(VSSQ) U2.D1(VSSQ) U2.D8(VSSQ) U2.E1(VSS) U2.E2(VSSQ) U2.E8(VSSQ) U2.F9(VSSQ) U2.G1(VSSQ) U2.G8(VSS) U2.G9(VSSQ) U2.J2(VSS) U2.J8(VSS) U2.M1(VSS) U2.M9(VSS) U2.P1(VSS) U2.P9(VSS) U2.T1(VSS) U2.T9(VSS) U3.A9(VSS) U3.B1(VSSQ) U3.B3(VSS) U3.B9(VSSQ) U3.D1(VSSQ) U3.D8(VSSQ) U3.E1(VSS) U3.E2(VSSQ) U3.E8(VSSQ) U3.F9(VSSQ) U3.G1(VSSQ) U3.G8(VSS) U3.G9(VSSQ) U3.J2(VSS) U3.J8(VSS) U3.M1(VSS) U3.M9(VSS) U3.P1(VSS) U3.P9(VSS) U3.T1(VSS) U3.T9(VSS) U4.2(GND) U5.1(A0) U5.2(A1) U5.3(A2) U5.4(GND) U5.7(WP) U7.3(GND) U7.8(GND) U8.3(GND) U8.8(GND) U9.3(GND) U9.8(GND) U10.EP1(GND1) U10.EP2(GND2) U10.EP3(GND3) U10.EP4(GND4) U10.EP5(GND5) U10.EP6(GND6) U10.EP7(GND7) U10.EP8(GND8) U10.EP9(GND9) U10.EXP_PAD(GND) U13.9(PGND2) U13.16(PGND3) U13.22(AGND) U13.46(PGND1) U13.N1(GND_PAD) U13.N2(GND_PAD) U13.N3(GND_PAD) U13.N4(GND_PAD) U13.N5(GND_PAD) U13.N6(GND_PAD) U13.N7(GND_PAD) U13.N8(GND_PAD) U13.N9(GND_PAD) U13.N10(GND_PAD) U13.N11(GND_PAD) U13.N12(GND_PAD) U13.N13(GND_PAD) U13.N14(GND_PAD) U13.N15(GND_PAD) U13.N16(GND_PAD) U13.N17(GND_PAD) U13.VSS(GND_PAD) U14.2(VSS) U15.2(GND) U16.2(GND) U17.2(GND) U23.A6(GND) U23.C4(GND) U23.E7(GND) U23.G5(GND) U23.H10(GND) U23.J5(GND) U23.K8(GND) U23.N2(GND) U23.N5(GND) U23.P4(GND) U23.P6(GND) U$1.GND U$2.1(GND) U$2.3(GND2) U$2.20(GND3) U$2.31(GND4) U$2.33(GND5) U$2.36(GND6) U$3.P$2 U$3.P$4 U$4.7 U$4.GND1(GND) U$4.GND2(GND) U$5.GND U$5.P$3 U$6.GND1(CASE) U$6.GND2(CASE) U$6.P$2(VCC) U$7.48(NC10) U$7.49(NC11) U$7.50(NC12) U$7.51(NC13) U$7.53(GND) U$7.54(GND2) U$7.P$1(GND3) U$7.P$56(GND4) U$8.P$1(GND) U$15.P$3(CASE) U$15.P$4(CASE) U$17.BASE@1(GNDCASE) U$17.BASE@2(GNDCASE) U$17.GND U$17.P$1(GNDCASE) U$17.P$2(GNDCASE) U$17.SPRT@3(GNDCASE) U$17.SPRT@4(GNDCASE) U$18.P$1 U$20.P$1 U$21.P$2 U$21.P$4 U$23.P$2 U$23.P$4 U$27.GND1(GND) U$27.GND2(GND) U$29.2(GND) U$31.GND U$31.P$2 U$32.GND U$32.P$2 UART0.3 UP.P$2(S) USB2.1.4 USB2.2.4 VR1.2(VSS)
GNDA: C59.2 C125.1 C126.1 C127.1 C128.1 C129.1 C209.2 R43.2 R83.2(1.2) U1.U19(AGND)
GPIO0: CN1.2 U13.19(GPIO0/LDO) U$33.2'
GPIO1: CN1.4 U13.18(GPIO1) U$33.2
HCEC: HDMI.13 U1.P23(CEC_HDMI/HCEC) U9.1(IN1) U9.10(OUT1)
HDMI_5V_SOURCE: FUSE1.2 HDMI.18
HHPD: HDMI.19 R47.1 U1.P22(HPD_HDMI/HHPD) U9.5(IN4) U9.6(OUT4)
HPCOM: C52.1 R114.1 U1.AA19(HPCOM) U1.AA20(HPCOMFB) U$24.2(GND) U$27.GND(AGND)
HPOUTL: TP6.1(PP) U1.Y19(HPOUTL/HPL) U$27.3B(3_CHLIN)
HPOUTR: TP5.1(PP) U1.W19(HPOUTR/HPR) U$27.3A(2_CHRIN)
HSCL: HDMI.15 R45.1 U1.R23(SCL_HDMI/HSCL) U9.2(IN2) U9.9(OUT2)
HSDA: HDMI.16 R46.1 U1.R22(SDA_HDMI/HSDA) U9.4(IN3) U9.7(OUT3)
HTX0N: HDMI.9 U1.V22(TX0N_HDMI/HTX0N) U8.2(IN2) U8.9(OUT2)
HTX0P: HDMI.7 U1.V23(TX0P_HDMI/HTX0P) U8.1(IN1) U8.10(OUT1)
HTX1N: HDMI.6 U1.U22(TX1N_HDMI/HTX1N) U7.5(IN4) U7.6(OUT4)
HTX1P: HDMI.4 U1.U23(TX1P_HDMI/HTX1P) U7.4(IN3) U7.7(OUT3)
HTX2N: HDMI.3 U1.T22(TX2N_HDMI/HTX2N) U7.2(IN2) U7.9(OUT2)
HTX2P: HDMI.1 U1.T23(TX2P_HDMI/HTX2P) U7.1(IN1) U7.10(OUT1)
HTXCN: HDMI.12 U1.W22(TXCN_HDMI/HTXCN) U8.5(IN4) U8.6(OUT4)
HTXCP: HDMI.10 U1.W23(TXCP_HDMI/HTXCP) U8.4(IN3) U8.7(OUT3)
IPSOUT: C113.2 C114.2 C122.2 C155.2 C162.1 C170.1 C174.1 C182.2 C186.1 C202.1 C208.2 C210.1 IPSOUT.1(PP) L1.P$1 L15.1 R27.1 R154.1 SV1.1 U1-A.6(VDD) U13.7(VIN2) U13.13(LDO24IN) U13.14(VIN3) U13.21(APS) U13.34(IPSOUT) U13.35(IPSOUT) U13.40(LDO3IN) U13.44(VIN1) U14.6(VIN) U15.4(IN) U16.5(IN) U17.4(IN)
LCD_B0_D0: U1.AB15(LCD0_D0/LVDS0_VP0/PD0) U$7.12(B0)
LCD_B1_D1: U1.AC15(LCD0_D1/LVDS0_VN0/PD1) U$7.13(B1)
LCD_B2_D2: U1.AB14(LCD0_D2/LVDS0_VP1/PD2) U$7.14(B2)
LCD_B3_D3: U1.AC14(LCD0_D3/LVDS0_VN1/PD3) U$7.15(B3)
LCD_B4_D4: U1.AB13(LCD0_D4/LVDS0_VP2/PD4) U$7.16(B4)
LCD_B5_D5: U1.AC13(LCD0_D5/LVDS0_VN2/PD5) U$7.17(B5)
LCD_B6_D6: U1.AB12(LCD0_D6/LVDS0_VPC/PD6) U$7.18(B6)
LCD_B7_D7: U1.AC12(LCD0_D7/LVDS0_VNC/PD7) U$7.19(B7)
LCD_CLK: R24.2 U1.Y9(LCD0_CLK/SMC_VCCEN/PD24)
LCD_DE: U1.AA9(LCD0_DE/SMC_RST/PD25) U$7.52(ENB)
LCD_G0_D8: U1.AB11(LCD0_D8/LVDS0_VP3/PD8) U$7.20(G0)
LCD_G1_D9: U1.AC11(LCD0_D9/LVDS0_VN3/PD9) U$7.21(G1)
LCD_G2_D10: U1.Y15(LCD0_D10/LVDS1_VP0/PD10) U$7.22(G2)
LCD_G3_D11: U1.AA15(LCD0_D11/LVDS1_VN0/PD11) U$7.23(G3)
LCD_G4_D12: U1.Y14(LCD0_D12/LVDS1_VP1/PD12) U$7.24(G4)
LCD_G5_D13: U1.AA14(LCD0_D13/LVDS1_VN1/PD13) U$7.25(G5)
LCD_G6_D14: U1.Y13(LCD0_D14/LVDS1_VP2/PD14) U$7.26(G6)
LCD_G7_D15: U1.AA13(LCD0_D15/LVDS1_VN2/PD15) U$7.27(G7)
LCD_HSYNC: U1.AB9(LCD0_HSYNC/SMC_SLK/PD26) U$7.36(HYSNC)
LCD_R0_D16: U1.Y12(LCD0_D16/LVDS1_VPC/PD16) U$7.28(R0)
LCD_R1_D17: U1.AA12(LCD0_D17/LVDS1_VNC/PD17) U$7.29(R1)
LCD_R2_D18: U1.Y11(LCD0_D18/LVDS1_VP3/PD18) U$7.30(R2)
LCD_R3_D19: U1.AA11(LCD0_D19/LVDS1_VN3/PD19) U$7.31(R3)
LCD_R4_D20: U1.Y10(LCD0_D20/CSI1_MCLK/PD20) U$7.32(R4)
LCD_R5_D21: U1.AA10(LCD0_D21/SMC_VPPEN/PD21) U$7.33(R5)
LCD_R6_D22: U1.AB10(LCD0_D22/SMC_VPPPP/PD22) U$7.34(R6)
LCD_R7_D23: U1.AC10(LCD0_D23/SMC_DET/PD23) U$7.35(R7)
LCD_VSYNC: U1.AC9(LCD0_VSYNC/SMC_SDA/PD27) U$7.37(VSYNC)
LDO3_2.8V [PWR]: 2.8V_LDO3.1(PP) C106.2 C185.1 U1.F19(VCC_CSI0/VCC-PE) U13.41(LDO3)
LDO4_2.8V [PWR]: 2.8V_LDO4.1(PP) C107.2 C188.1 U1.E18(VCC_CSI1/VCC-PG) U13.11(LDO4)
LED+: C153.2 C154.2 D6.C LED+.1(PP) U14.5(OVP) U$7.3(VBL+) U$7.4(VBL+2)
LED-: LED-.1(PP) R28.1 R29.1 R49.1 U$7.1(VBL-) U$7.2(VBL-2)
LINEINL: LINEINL.1(PP) U1.AB20(LINEINL)
LINEINR: LINEINR.1(PP) U1.AB21(LINEINR)
LR: U$24.3(4_RIGHT_IN) U$27.2A(5_CHROUT)
LRADC0: C209.1 LRADC0.1(PP) R87.2 U1.AB23(LRADC0)
LRADC1: C59.1 LRADC1.1(PP) R104.2 U1.AB22(LRADC1)
MCLK-IN: R37.2 U$2.30(TCXO_IN)
MIC1OUTN: MIC1OUTN.1(PP) U1.AC23(MIC1OUTN)
MIC1OUTP: MIC1OUTP.1(PP) U1.AC22(MIC1OUTP)
MICIN1: MICIN1.1(PP) R109.2 U1.AC20(MICIN1)
MICIN2: MICIN2.1(PP) U1.AC21(MICIN2)
N$1: C133.2 C134.2 U1.AC19(HPVCC/HPBP)
N$2: R14.2 U1.AA7(SZQ)
N$3: R7.2 U2.L8(ZQ)
N$4: LED2.A R70.2
N$5: R22.2 R23.2 U14.4(CE)
N$6: D6.A L1.P$2 U14.1(LX)
N$7: D2.C UART0.2
N$8: L14.1 U15.3(LX)
N$9: R109.1 R114.2 U$24.1(MIC)
N$10: D1.C R113.2
N$11: LED1.C U13.36(CHGLED)
N$12: R80.1 U13.27(LDO1SET)
N$13: C83.2 R36.2 U$3.P$1
N$14: C110.2 Q2.4 R35.1 U1.F1(CLK32K_IN)
N$15: R8.2 U3.L8(ZQ)
N$16: C50.1 R24.1 U$7.38(DCLK)
N$17: R28.2 U14.3(FB)
N$18: R112.2 U4.3(ISET)
N$19: C201.2 R86.2 R90.1 U15.5(FB)
N$20: C28.2 J1.41
N$21: R75.1 U$5.P$2
N$22: C20.2 J1.43
N$23: R32.1 U$2.17(SDIO_DATA_CLK)
N$24: C54.1 L2.2 U4.1(OUT)
N$25: C7.2 J1.47
N$26: C19.2 J1.49
N$27: C73.2 R76.2 R78.1 R88.1
N$28: L4.2 U$2.21(VIN_LDO_OUT)
N$29: C81.1 C82.2 L4.1 U$2.23(VIN_LDO)
N$30: BACKUP.1(PP) U13.30(BACKUP)
N$31: R37.1 U$29.6(OUT1)
N$32: R88.2 U$8.P$2(ANT)
N$33: R78.2 U$30.SIGNAL(ANT)
N$34: AXP2.1(PP) U13.5(GPIO2)
N$35: DS.1(PP) U23.H5(DATA_STROBE)
N$36: AXP3.1(PP) U13.3(GPIO3)
N$37 [PWR]: R25.1 U$2.29(VDD_TCXO)
N$43: LED1.A R82.2
N$47: LED3.A R110.2
N$48: C51.1 R26.2
N$64: L16.1 U17.3(LX)
N$66: C211.2 R91.2 R92.1 U17.5(FB)
N$70: R33.2 U1-A.4(IN_N)
N$71: R31.2 U1-A.3(IN_P)
N$72: C52.2 R33.1
N$73: FB2-A.1 U1-A.8(VO_N)
N$74: FB1-A.1 U1-A.5(VO_P)
N$75: C51.2 R31.1
N$76: U$24.4(5_LEFT_IN) U$27.2B(4_CHLOUT)
N$77: LAN1.1(TD+) R55.1 U10.29(TXP)
N$81: LAN1.2(TD-) R58.1 U10.28(TXN)
N$82: LAN1.7(RD+) R59.1 U10.31(RXP)
N$83: LAN1.8(RD-) R62.1 U10.30(RXN)
N$87: LAN1.AY U10.3(LED1/REGOFF)
N$88: LAN1.AG R93.1 U10.2(LED2/NINTSEL)
N$89: LAN1.KY R53.1
N$90: R51.2 U10.32(RBIAS)
N$91: C61.2 C62.2 U10.6(VDDCR)
N$94: LAN1.KG R52.1
N$116: C115.2 Q2.1 R35.2 U1.F2(CLK32K_OUT)
N$119: R72.2 U1.V21(REXT_SATA)
N$120: R74.2 U13.23(BIAS)
N$122: C128.2 C129.2 U1.W21(VRP)
N$123: D5.2(A) L15.2 U16.1(LX)
N$126: R85.1 R89.1 U16.3(FB)
N$127: L11.1 U13.45(LX1)
N$128: C159.1 C160.1 L11.2 R66.1 U13.43(CHSENSE)
N$130: L12.1 U13.8(LX2)
N$131: L13.1 U13.15(LX3)
N$132: C180.2 U13.24(VREF)
N$133: C125.2 U1.W20(VRA1)
N$139: C187.2 R75.2 U13.47(PWRON)
N$140: R27.2 R77.2 U13.4(N_OE)
N$176: C126.2 C127.2 R43.1 U1.V20(VRA2)
N$190: R48.1 U1.T10(JTAG_SEL)
N$193: L3.2 U$1.GN3(SHIELD) U$1.GND2(SHIELD) USB2.GND1 USB2.GND2(GND1) USB2.GND3(GND1) USB2.GND4(GND1)
NALE: PC1.1(PP) U1.M22(NALE/SPI0_MISO/PC1)
NCE0: PC4.1(PP) U1.K23(NCE0/PC4)
NCLE: PC2.1(PP) U1.L23(NCLE/SPI0_CLK/PC2)
NDQ0/SDC2_D0: R118.2 U1.H23(NDQ0/SDC2_D0/PC8) U23.A3(DAT0)
NDQ1/SDC2_D1: U1.H22(NDQ1/SDC2_D1/PC9) U23.A4(DAT1)
NDQ2/SDC2_D2: U1.G23(NDQ2/SDC2_D2/PC10) U23.A5(DAT2)
NDQ3/SDC2_D3: U1.G22(NDQ3/SDC2_D3/PC11) U23.B2(DAT3)
NDQ4/SDC2_D4: U1.H21(NDQ4/PC12) U23.B3(DAT4)
NDQ5/SDC2_D5: U1.H20(NDQ5/PC13) U23.B4(DAT5)
NDQ6/SDC2_D6: U1.G21(NDQ6/PC14) U23.B5(DAT6)
NDQ7/SDC2_D7: U1.G20(NDQ7/PC15) U23.B6(DAT7)
NMI_N: R113.1 U1.F5(NMI#) U13.48(IRQ/WAKEUP)
NRB0/SDC2_CMD: R119.2 U1.J23(NRB0/SDC2_CMD/PC6) U23.M5(CMD)
NRE: PC5.1(PP) U1.K22(NRE#/PC5)
NRST: C55.2 R54.2 R63.2 R94.2 U10.19(NRST)
NTC: R67.1 U13.37(TS) U$18.P$2
NWE: PC0.1(PP) U1.M23(NWE#/SPI0_MOSI/PC0)
P_AD: DOWN.P$1(GND) R60.2 U1.B4(LCD1_D7/ATAD3/UART5_RX/MS_CLK/EINT7/CSI1_D7/PH7)
P_AL: LEFT.P$1(GND) R50.2 U1.B5(LCD1_D4/ATAD0/UART4_TX/EINT4/CSI1_D4/PH4)
P_AR: R57.2 RIGHT.P$1(GND) U1.B1(LCD1_D16/ATAD12/KP_IN6/SMC_DET/EINT16/CSI1_D16/PH16)
P_AU: PH19.1(PP) R56.2 U1.D1(LCD1_D19/ATAD15/KP_OUT1/SMC_SDA/EINT19/CSI1_D19/PH19) UP.P$1(GND)
P_CS: U$7.9(CS)
P_K1: K1.P$1(GND) R98.2 U1.C3(LCD1_D12/ATAD8/PS2_SCK1/EINT12/CSI1_D12/PH12)
P_K2: K2.P$1(GND) R97.2 U1.A6(LCD1_D0/ATAA0/UART3_TX/EINT0/CSI1_D0/PH0)
P_K3: K3.P$1(GND) R73.2 U1.D2(LCD1_D20/ATAOE/CAN_TX/EINT20/CSI1_D20/PH20)
P_K4: K4.P$1(GND) R71.2 U1.B3(LCD1_D11/ATAD7/KP_IN3/MS_D3/EINT11/CSI1_D11/PH11)
P_K5: R133.2 SELECT3.P$1(GND) U1.A5(LCD1_D3/ATAIRQ/UART3_CTS/EINT3/CSI1_D3/PH3)
P_K6 [PWR]: R120.2 SELECT4.P$1(GND) U1.A2(LCD1_D13/ATAD9/PS2_SDA1/SMC_RST/EINT13/CSI1_D13/PH13)
P_L1: R111.2 U1.E2(LCD1_D23/ATACS0/KP_OUT3/SDC1_CLK/CSI1_D23/PH23) U$4.3
P_L2: R101.2 U1.F4(LCD1_VSYNC/ATAIOW/KP_OUT7/SDC1_D3/CSI1_VSYNC/PH27) U$4.6
P_R1: PH22.1(PP) R102.2 U1.E1(LCD1_D22/ATADACK/KP_OUT2/SDC1_CMD/CSI1_D22/PH22) U$4.4
P_R2: R99.2 U1.F3(LCD1_HSYNC/ATAIOR/KP_OUT6/SDC1_D2/CSI1_HSYNC/PH26) U$4.5
P_RST: U$7.8(/RESET)
P_SCL: U$7.10(SCL)
P_SDA: U$7.11(SDI)
P_SELECT: R61.2 SELECT.P$1(GND) U1.A1(LCD1_D15/ATAD11/KP_IN5/SMC_VPPPP/EINT15/CSI1_D15/PH15)
P_START: R68.2 START.P$1(GND) U1.B2(LCD1_D14/ATAD10/KP_IN4/SMC_VPPEN/EINT14/CSI1_D14/PH14)
PB2/PWM0: R22.1 U1.A14(PWM0/PB2)
PB3: SV6.14 U1.B14(IR0_TX/SPDIF_MCLK/STANBYWFI/PB3)
PB4: SV6.15 U1.A13(IR0_RX/PB4)
PB5: SV6.16 U1.B13(I2S_MCLK/AC97_MCLK/PB5)
PB9: U1.C12(I2S_DO1/PB9)
PB10: U1.C11(I2S_DO2/PB10)
PB11: U1.C10(I2S_DO3/PB11)
PB13: SV6.20 U1.B11(SPI2_CS1/SPDIF_DO/PB13)
PB14: SV6.21 U1.A10(JTAG_MS0/SPI2_CS0/PB14)
PB15: SV6.22 U1.B10(JTAG_CK0/SPI2_CLK/PB15)
PB16: SV6.23 U1.A9(JTAG_DO0/SPI2_MOSI/PB16)
PB17: SV6.24 U1.B9(JTAG_DI0/SPI2_MISO/PB17)
PB18/TWI1-SCK: R44.2 U1.A8(TWI1_SCK/PB18) U5.6(SCL)
PB19/TWI1-SDA: R42.1 U1.B8(TWI1_SDA/PB19) U5.5(SDA)
PB20: U1.C8(TWI2_SCK/PB20)
PB21: U1.C7(TWI2_SDA/PB21)
PC3: PC3.1(PP) U1.L22(NCE1/PC3)
PC7: R117.1 U1.J22(NRB1/SDC2_CLK/PC7)
PC16/NWP/SDC2_RST: R121.2 U1.M21(NWP/PC16) U23.K5(RST_N)
PC17/USB0-DRV: PC17.1(PP) R65.2 U1.F23(NCE2/PC17) U13.6(N_VBUSEN)
PC18: R116.2 SV2.3 U1.F22(NCE3/PC18) U$32.P$3
PC19: PC19.1(PP) U1.L21(NCE4/SPI2_CS0/PC19)
PC20: PC20.1(PP) U1.K21(NCE5/SPI2_CLK/PC20)
PC21: PC21.1(PP) U1.J21(NCE6/SPI2_MOSI/PC21)
PC22: PC22.1(PP) R115.2 U1.J20(NCE7/SPI2_MISO/PC22) U$31.P$3
PC23/SPI0_CS0: PC23.1(PP) U1.G19(SPI0_CS0/PC23)
PC24: PG24.1(PP) U1.F21(NDQS/PC24)
PE0: SV2.6 U1.E23(TS0_CLK/CSI0_PCLK/PE0)
PE1 [PWR]: SV2.5 U1.E22(TS0_ERR/CSI0_MCLK/PE1)
PE2: SV2.8 U1.D23(TS0_SYNC/CSI0_HSYNC/PE2)
PE3 [PWR]: SV2.7 U1.D22(TS0_DVLD/CSI0_VSYNC/PE3)
PE4: SV2.10 U1.C23(TS0_D0/CSI0_D0/PE4)
PE5: SV2.9 U1.C22(TS0_D1/CSI0_D1/PE5)
PE6: SV6.3 U1.B23(TS0_D2/CSI0_D2/PE6)
PE7: SV6.4 U1.B22(TS0_D3/CSI0_D3/PE7)
PE8: SV6.5 U1.A23(TS0_D4/CSI0_D4/PE8)
PE9: SV6.6 U1.A22(TS0_D5/CSI0_D5/PE9)
PE10: SV6.7 U1.B21(TS0_D6/CSI0_D6/PE10)
PE11: SV6.8 U1.A21(TS0_D7/CSI0_D7/PE11)
PG0: PG0.1(PP) U1.F20(TS1_CLK/CSI1_PCLK/SDC1_CMD/PG0)
PG1: PG1.1(PP) U1.E21(TS1_ERR/CSI1_MLCK/SDC1_CLK/PG1)
PG2: PG2.1(PP) U1.E20(TS1_SYNC/CSI1_HSYNC/SDC1_D0/PG2)
PG3: PG3.1(PP) U1.D21(TS1_DVLD/CSI1_VSYNC/SDC1_D1/PG3)
PG4: PG4.1(PP) U1.D20(TS1_D0/CSI1_D0/SDC1_D2/CSI0_D8/PG4)
PG5: PG5.1(PP) U1.C21(TS1_D1/CSI1_D1/SDC1_D3/CSI0_D9/PG5)
PG6: PG6.1(PP) U1.E19(TS1_D2/CSI1_D2/UART3_TX/CSI0_D10/PG6)
PG7: PG7.1(PP) U1.C20(TS1_D3/CSI1_D3/UART3_RX/CSI0_D11/PG7)
PG8: PG8.1(PP) U1.D19(TS1_D4/CSI1_D4/UART3_RTS/CSI0_D12/PG8)
PG9: PG9.1(PP) U1.C19(TS1_D5/CSI1_D5/UART3_CTS/CSI0_D13/PG9)
PG10: PG10.1(PP) U1.D18(TS1_D6/CSI1_D6/UART4_TX/CSI0_D14/PG10)
PG11: SV6.13 U1.C18(TS1_D7/CSI1_D7/UART4_RX/CSI0_D15/PG11)
PH2/LED: PH2.1(PP) R110.1 U1.C6(LCD1_D2/ATAA2/UART3_RTS/EINT2/CSI1_D2/PH2)
PH5: PH5.1(PP) U1.C5(LCD1_D5/ATAD1/UART4_RX/EINT5/CSI1_D5/PH5)
PH6/EPHY-RST#: PH6.1(PP) R54.1 U1.A4(LCD1_D6/ATAD2/UART5_TX/MS_BS/EINT6/CSI1_D6/PH6)
PH8: PH8.1(PP) U1.C4(LCD1_D8/ATAD4/KP_IN0/MS_D0/EINT8/CSI1_D8/PH8)
PH17: PH17.1(PP) U1.C1(LCD1_D17/ATAD13/KP_IN7/SMC_VCCEN/EINT17/CSI1_D17/PH17)
PH21: PH21.1(PP) U1.D3(LCD1_D21/ATADREQ/CAN_RX/EINT21/CSI1_D21/PH21)
PI0: SV6.10 U1.A20(GPS_CLK/PI0)
PI1: SV6.9 U1.B20(GPS_SIGN/PI1)
PI2: SV6.12 U1.A19(GPS_MAG/PI2)
PI3: SV6.11 U1.B19(PWM1/PI3)
PI10: PI10.1(PP) U1.C17(SPI0_CS0/UART5_TX/EINT22/PI10)
PI11: PI11.1(PP) U1.D17(SPI0_CLK/UART5_RX/EINT23/PI11)
PI13: PI13.1(PP) U1.D16(SPI0_MISO/UART6_RX/EINT25/PI13)
PI14: U1.C15(PS2_SCK1/TCLKIN0/EINT26/SPI0_CS1/PI14)
PI15: U1.D15(PS2_SDA1/TCLKIN1/EINT27/SPI1_CS1/PI15)
PI20: PI20.1(PP) U1.E14(HSCL/UART7_TX/PS2_SCK0/PI20)
PI21: U1.E13(HSDA/UART7_RX/PS2_SDA0/PI21)
RASN: U1.T4(SRAS) U2.J3(#RAS) U3.J3(#RAS)
RESET_N: C109.2 R30.1 R94.1 U1.C14(RESET#) U13.25(PWROK)
RXM_SATA: C20.1 U1.U20(RXM_SATA)
RXP_SATA: C28.1 U1.U21(RXP_SATA)
SA0: U1.W4(SA0) U2.N3(A0) U3.N3(A0)
SA1: U1.R4(SA1) U2.P7(A1) U3.P7(A1)
SA2: U1.U4(SA2) U2.P3(A2) U3.P3(A2)
SA3: U1.M4(SA3) U2.N2(A3) U3.N2(A3)
SA4: U1.Y4(SA4) U2.P8(A4) U3.P8(A4)
SA5: U1.N4(SA5) U2.P2(A5) U3.P2(A5)
SA6: U1.V4(SA6) U2.R8(A6) U3.R8(A6)
SA7: U1.M3(SA7) U2.R2(A7) U3.R2(A7)
SA8: U1.AA3(SA8) U2.T8(A8) U3.T8(A8)
SA9: U1.P4(SA9) U2.R3(A9) U3.R3(A9)
SA10: U1.L3(SA10) U2.L7(A10/AP) U3.L7(A10/AP)
SA11: U1.W3(SA11) U2.R7(A11) U3.R7(A11)
SA12: U1.P3(SA12) U2.N7(A12/#BC) U3.N7(A12/#BC)
SA13: U1.Y3(SA13) U2.T3(A13) U3.T3(A13)
SA14: U1.R3(SA14) U2.T7(NC/A14) U3.T7(NC/A14)
SA15: U1.AA4(SCS1) U2.M7(NC) U3.M7(NC)
SCK: R9.2 U1.V1(SCK)
SCK#: R10.2 U1.V2(SCK#/SCKB)
SCS0: U1.V3(SCS0/SCS) U2.L2(#CS) U3.L2(#CS)
SD0-CLK: R11.2 U1.L20(SDC0_CLK/UART0_TX/PF2)
SD0-CLKIN: R11.1 SD/MMC.5(CLK/SCLK)
SD0-CMD: R2.1 SD/MMC.3(CMD/DI) U1.L19(SDC0_CMD/JTAG_DO1/PF3)
SD0-D0: R3.1 SD/MMC.7(DAT0/DO) U1.M19(SDC0_D0/JTAG_DI1/PF1)
SD0-D1: R5.1 SD/MMC.8(DAT1/RES) U1.M20(SDC0_D1/JTAG_MS1/PF0)
SD0-D2: R6.1 SD/MMC.1(DAT2/RES) U1.K19(SDC0_D2/JTAG_CK1/PF5)
SD0-D3: R13.1 SD/MMC.2(CD/DAT3/CS) U1.K20(SDC0_D3/UART0_RX/PF4)
SD0-DET#: R41.1 SD/MMC.9(CP_E) U1.B6(LCD1_D1/ATAA1/UART3_RX/EINT1/CSI1_D1/PH1)
SD1-CLK: R32.2 U1.B18(SDC3_CLK/PI5)
SD1-CMD: R84.2 U1.A18(SDC3_CMD/PI4) U$2.16(SDIO_DATA_CMD)
SD1-D0: R103.2 U1.A17(SDC3_D0/PI6) U$2.18(SDIO_DATA_0)
SD1-D1: R105.2 U1.B17(SDC3_D1/PI7) U$2.19(SDIO_DATA_1)
SD1-D2: R106.2 U1.A16(SDC3_D2/PI8) U$2.14(SDIO_DATA_2)
SD1-D3: R107.2 U1.B16(SDC3_D3/PI9) U$2.15(SDIO_DATA_3)
SDQM0: U1.AC6(SDQM0) U2.E7(DML)
SDQM1: U1.W1(SDQM1) U2.D3(DMU)
SDQM2: U1.R2(SDQM2) U3.E7(DML)
SDQM3: U1.G1(SDQM3) U3.D3(DMU)
SDQS0: U1.AB6(SDQS0) U2.F3(DQSL)
SDQS0_N: U1.AC5(SDQS0#/SDQS0B) U2.G3(#DQSL)
SDQS1: U1.AB1(SDQS1) U2.C7(DQSU)
SDQS1_N: U1.AA2(SDQS1#/SDQS1B) U2.B7(#DQSU)
SDQS2: U1.R1(SDQS2) U3.F3(DQSL)
SDQS2_N: U1.P2(SDQS2#/SDQS2B) U3.G3(#DQSL)
SDQS3: U1.K1(SDQS3/SDQS3) U3.C7(DQSU)
SDQS3_N: U1.J2(SDQS3#/SDQS3B) U3.B7(#DQSU)
TPX1: C139.2 CN2.2 U1.Y22(XP_TP/TPX1)
TPX2: C140.2 CN2.4 U1.AA22(XN_TP/TPX2)
TPY1: C141.2 CN2.1 U1.Y23(YP_TP/TPY1)
TPY2: C142.2 CN2.3 U1.AA23(YN_TP/TPY2)
TVIN0: TVOUT4.1(PP) U1.AC18(TVIN0/GND)
TVIN1: TVOUT5.1(PP) U1.AB18(TVIN1/GND)
TVIN2: TVOUT6.1(PP) U1.AA17(TVIN2/VCC25-TVIN)
TVIN3: TVOUT7.1(PP) U1.Y17(TVIN3/GND)
TVOUT0: TVOUT0.1(PP) U1.AC16(TVOUT0/VGA-G/TVIN0)
TVOUT1: TVOUT1.1(PP) U1.AB16(TVOUT1/VGA-B/TVIN1)
TVOUT2: TVOUT2.1(PP) U1.AC17(TVOUT2/VGA-R/TVIN2)
TVOUT3: TVOUT3.1(PP) U1.AB17(TVOUT3/TVIN3)
TWI0-SCK: R79.1 U1.A15(TWI0_SCK/PB0) U13.2(SCK)
TWI0-SDA: R81.1 U1.B15(TWI0_SDA/PB1) U13.1(SDA)
TXM_SATA: C7.1 U1.T21(TXM_SATA)
TXP_SATA: C19.1 U1.T20(TXP_SATA)
UART0-RX: D2.A R64.1 U1.B7(UART0_RX/IR1_RX/PB23)
UART0-TX: U1.A7(UART0_TX/IR1_TX/PB22) UART0.1
UBOOT_SEL: U1.W8(UBOOT_SEL) UBOOT.1(PP)
UDM0: U1.N20(DM0) USB2.1.2
UDM1: U1.P20(DM1) USB2.2.2
UDM2: U1.R20(DM2) U$1.D-
UDP0: U1.N21(DP0) USB2.1.3
UDP1: U1.P21(DP1) USB2.2.3
UDP2: U1.R21(DP2) U$1.D+
V+: 1.5V.1(PP) C1.1 C2.2 C3.2 C4.2 C5.2 C6.2 C8.2 C9.2 C11.2 C12.2 C13.2 C21.2 C22.2 C23.2 C24.2 C27.2 C30.2 C31.2 C32.2 C33.2 C34.2 C201.1 C203.1 C204.1 CN1.3 L14.2 R1.2 R86.1 U1.G5(VCC_DRAM) U1.H5(VCC_DRAM) U1.L5(VCC_DRAM) U1.M5(VCC_DRAM) U1.R5(VCC_DRAM) U1.T5(VCC_DRAM) U1.W5(VCC_DRAM) U1.W6(VCC_DRAM) U1.W7(VCC_DRAM) U1.Y6(VCC_DRAM) U2.A1(VDDQ) U2.A8(VDDQ) U2.B2(VDD) U2.C1(VDDQ) U2.C9(VDDQ) U2.D2(VDDQ) U2.D9(VDD) U2.E9(VDDQ) U2.F1(VDDQ) U2.G7(VDD) U2.H2(VDDQ) U2.H9(VDDQ) U2.K2(VDD) U2.K8(VDD) U2.N1(VDD) U2.N9(VDD) U2.R1(VDD) U2.R9(VDD) U3.A1(VDDQ) U3.A8(VDDQ) U3.B2(VDD) U3.C1(VDDQ) U3.C9(VDDQ) U3.D2(VDDQ) U3.D9(VDD) U3.E9(VDDQ) U3.F1(VDDQ) U3.G7(VDD) U3.H2(VDDQ) U3.H9(VDDQ) U3.K2(VDD) U3.K8(VDD) U3.N1(VDD) U3.N9(VDD) U3.R1(VDD) U3.R9(VDD) U$33.1 U$33.1' VRAM.1 ; supply symbol labelled 1.5V
VCC [PWR]: 3.3V.1(PP) C10.1 C49.2 C60.2 C71.1 C72.2 C74.2 C75.2 C76.2 C79.2 C80.1 C92.2 C93.2 C94.2 C95.2 C96.2 C97.2 C98.2 C99.2 C100.2 C112.2 C120.2 C121.2 C132.2 C144.2 C164.1 C191.1 C196.1 C198.2 C211.1 C212.1 C213.1 D1.A J1.2 J1.4 J1.70 J1.72 J1.74 L5.2 L16.2 L17.1 R2.2 R3.2 R5.2 R6.2 R12.2 R13.2 R18.1 R19.1 R20.1 R21.1 R25.2 R30.2 R34.2 R41.2 R42.2 R44.1 R50.1 R56.1 R57.1 R60.1 R61.1 R63.1 R64.2 R68.1 R70.1 R71.1 R73.1 R79.2 R81.2 R84.1 R91.1 R96.1 R97.1 R98.1 R99.1 R100.1 R101.1 R102.1 R103.1 R105.1 R106.1 R107.1 R111.1 R115.1 R116.1 R120.1 R133.1 SD/MMC.4(VDD) SV2.1 SV2.4 SV6.1 U1.AB19(HPVCCIN/VCCHP) U1.H8(VCC) U1.H9(VCC) U1.H10(VCC) U1.H15(VCC) U1.H19(VCC_NAND/VCC-PC) U1.J8(VCC) U1.J9(VCC) U1.J10(VCC) U1.J14(VCC) U1.J19(VCC_NAND) U1.L15(UVCC_T/VCC-USB) U1.L16(UVCC_C/VCC-USB) U1.N19(VCC_CARD/VCC-PF) U1.P16(PLLVP25/VCC-PLL) U1.T13(VP_HDMI/VCC-HDMI) U1.W12(VCC_LVDS) U1.W13(VCC_LVDS) U1.W14(VCC_LVDS) U1.W15(VCC33_TVOUT/TVOUT0) U1.W16(VCC33_TVIN/TVOUT2) U5.8(VCC) U10.12(VDDIO) U$2.9(VBAT) U$2.22(VDDIO) U$7.41(VCC) U$7.42(VCC2) U$29.5(VCC) VR1.1(VIN) VR1.3(CE) ; supply symbol labelled 3.3V
VCC/2: 1.2V_CPU.1(PP) C65.2 C66.2 C67.2 C68.2 C69.2 C70.2 C166.1 C167.1 L12.2 U1.H11(VDD_CPU) U1.H12(VDD_CPU) U1.H13(VDD_CPU) U1.H14(VDD_CPU) U1.J12(VDD_CPU) U1.J13(VDD_CPU) U13.10(DCDC2) ; supply symbol labelled 1.2V_CPU
VCCINT: 1.2V_INT.1(PP) C15.2 C16.2 C17.2 C18.2 C37.2 C38.2 C39.2 C40.2 C41.2 C42.2 C43.2 C45.2 C46.2 C148.2 C172.1 C173.1 C181.2 C184.2 L13.2 U1.J15(VDD_INT/VDD-SYS) U1.J16(VDD_INT) U1.K9(VDD_INT) U1.K10(VDD_INT) U1.K15(VDD_INT) U1.K16(ULVDD/VDD-USB) U1.L8(VDD_INT) U1.L9(VDD_INT) U1.M8(VDD_DLL) U1.M15(VDD12_SATA) U1.M16(VDD12_SATA) U1.N9(VDD_DLL) U1.P9(VDD_DLL) U1.R9(VDD_INT) U1.R10(VDD_INT) U1.T8(VDD_INT) U13.17(DCDC3) ; supply symbol labelled 1.2V_INT
VDD: 2.5V.1(PP) C177.2 C178.2 C189.1 C192.1 C193.1 U1.N15(VDD25_SATA) U1.N16(VDD25_SATA) U1.W17(VDD25_TVIN/VRP-TVIN) VR1.5(VOUT) ; supply symbol labelled 2.5V
VDD_RTC: C118.2 C119.2 C179.1 U1.K8(RTC_VDD) U13.28(LDO1) VDD_RTC.1(PP)
VDDIM1 [PWR]: C85.1 C86.2 U23.C2(VDDI)
VINT: C176.2 U13.26(VINT)
VMIC: U1.AA21(VMIC) VMIC.1(PP)
VO+: C147.2 FB1-A.2 TP15.1(PP) U$15.P$1(VCC)
VO-: C146.2 FB2-A.2 TP16.1(PP) U$15.P$2(GND)
VPP [PWR]: 3.0VA.1(PP) C183.1 R87.1 R104.1 U1.T19(AVCC) U13.12(LDO2) U15.1(EN) ; supply symbol labelled 3.0VA
WEN: U1.T3(SWE) U2.L3(#WE) U3.L3(#WE)
WIFI-HOST-WAKE: R100.2 U1.A3(LCD1_D10/ATAD6/KP_IN2/MS_D2/EINT10/CSI1_D10/PH10) U$2.13(WL_HOST_WAKE)
WIFI-SHDN: R96.2 U1.D4(LCD1_D9/ATAD5/KP_IN1/MS_D1/EINT9/CSI1_D9/PH9) U$2.12(WL_REG_ON)
XIN: R36.1 R38.2 R39.1 U$29.1(IN1) U$29.4(OUT2)
XOUT: C84.2 R38.1 R40.1 U$3.P$3 U$29.3(IN2)
XTAL-IN: R39.2 U$2.10(XTAL_IN)
XTAL-OUT: R40.2 U$2.11(XTAL_OUT)
XTALI: C116.2 U1.N23(CLK24M_IN) U$21.P$1
XTALI2: C36.2 U10.4(XTAL2) U$23.P$1
XTALO: C117.2 U1.N22(CLK24M_OUT) U$21.P$3
XTALO2: C44.2 U10.5(XTAL1/CLKIN) U$23.P$3
Unconnected: HDMI.14 J1.1 J1.5 J1.6 J1.7 J1.8 J1.9 J1.10 J1.11 J1.20 J1.21 J1.22 J1.23 J1.24 J1.25 J1.26 J1.28 J1.29 J1.30 J1.31 J1.32 J1.34 J1.35 J1.36 J1.37 J1.38 J1.40 J1.42 J1.44 J1.46 J1.48 J1.50 J1.52 J1.53 J1.55 J1.59 J1.61 J1.63 J1.65 J1.66 J1.67 J1.68 J1.69 J1.75 J1.76 J1.77 R65.1 U1-A.2(NC) U1.AA16(VRP_TVIN/VCC-TVOUT) U1.J3(ODT1/SCK1B) U1.J4(SCKE1) U1.N8(ADBG/SADBG) U1.P8(SDBG0/SDDBG0) U1.P19(CLKM_SATA) U1.R8(SDBG1/SADBG1) U1.R14(VREGIO2_HDMI/NC) U1.R15(PLLVREG) U1.R16(PLLREGIO/NC) U1.R19(CLKP_SATA) U1.T14(VREGIO1_HDMI/HVREG1) U1.T15(PLLTEST) U1.T16(PLLDV) U1.Y16(VRN_TVIN/VCC-TVIN) U2.J1(NC) U2.J9(NC) U2.L1(NC) U2.L9(NC) U3.J1(NC) U3.J9(NC) U3.L1(NC) U3.L9(NC) U13.29(DC3SET) U16.6(NC) U$2.4(FM_RX) U$2.37(GPIO4) U$2.38(GPIO3) U$2.39(GPIO2) U$2.40(GPIO1) U$2.45(TP1) U$2.46(TP2) U$7.5(NC) U$7.6(NC1) U$7.7(NC2) U$7.39(NC3) U$7.40(NC4) U$7.43(NC5) U$7.44(NC6) U$7.45(NC7) U$7.46(NC8) U$7.47(NC9) U$17.D+ U$17.D- U$17.ID U$18.P$4 U$30.NC(GND)

### Buses
SA[0..14]
DQ[0..31]
BA[0..2],CLK,CLKN,CKE,CASN,RASN,WEN,SDQM[0..3],SDQS[0..3],SDQS0_N,SDQS1_N,SDQS2_N,SDQS3_N,DDR3_RST,DDR3_ODT,SCS0,SA15
LCD_D[0..7],LCD_D[8..15],LCD_D[16..23],LCD_HSYNC,LCD_VSYNC,LCD_CLK,LCD_DE
HTX0P,HTX0N,HTX1P,HTX1N,HTX2P,HTX2N,HTXCP,HTXCN,HSCL,HSDA,HHPD,HCEC
ETXD[0..3],ETXEN,ETXCK,ERXD[0..3],ERXDV,ERXCK,ERXERR,EMDC,EMDIO,ECOL,ECRS,EPHY-RST#

### Notes on the sheet
- 2 x [4Gb DDR3 SDRAM (256Mx16)]
- We have used a number of fully compatible
- but different DDR3 memories due to supply unavailability.
- In such cases the memory part name
- in the schematic might remain outdated.
- It is recommended to always refer to the
- exact memory name printed on the component itself.
- Ethernet | MAC Address
- EEPROM
- 16 Kbit
- (2048x8)
- Extensions
- I2C Address: 0xA0
- The PHY is setted up as follows:
- MODE: All capable(10/100Base).
- Auto-negotiation enabled.
- MII Configuration
- SMI address: 0x01
- LCD | Audio
- MicroSD
- 2*100nf removed as 
  they're somewhere else
- HDMI
- ToDo: Ferrite (select w/high Z at high F,
  low Z at low F). Try to block everything
  >1MHz or so.
- NOTE: For the best power on/off pop
  performance, the amplifier should be set in the
  shutdown mode prior to power on/off operation
  (set SD low to power down the amp).
- C3: Use 1uF to filter high frequency noise,
  or 10uF if lower frequency noise is present
- eMMC
- USB-HOSTs
- Joystick